# EAGLE design zok-atmega644-bob (EAGLE 6.5.0)
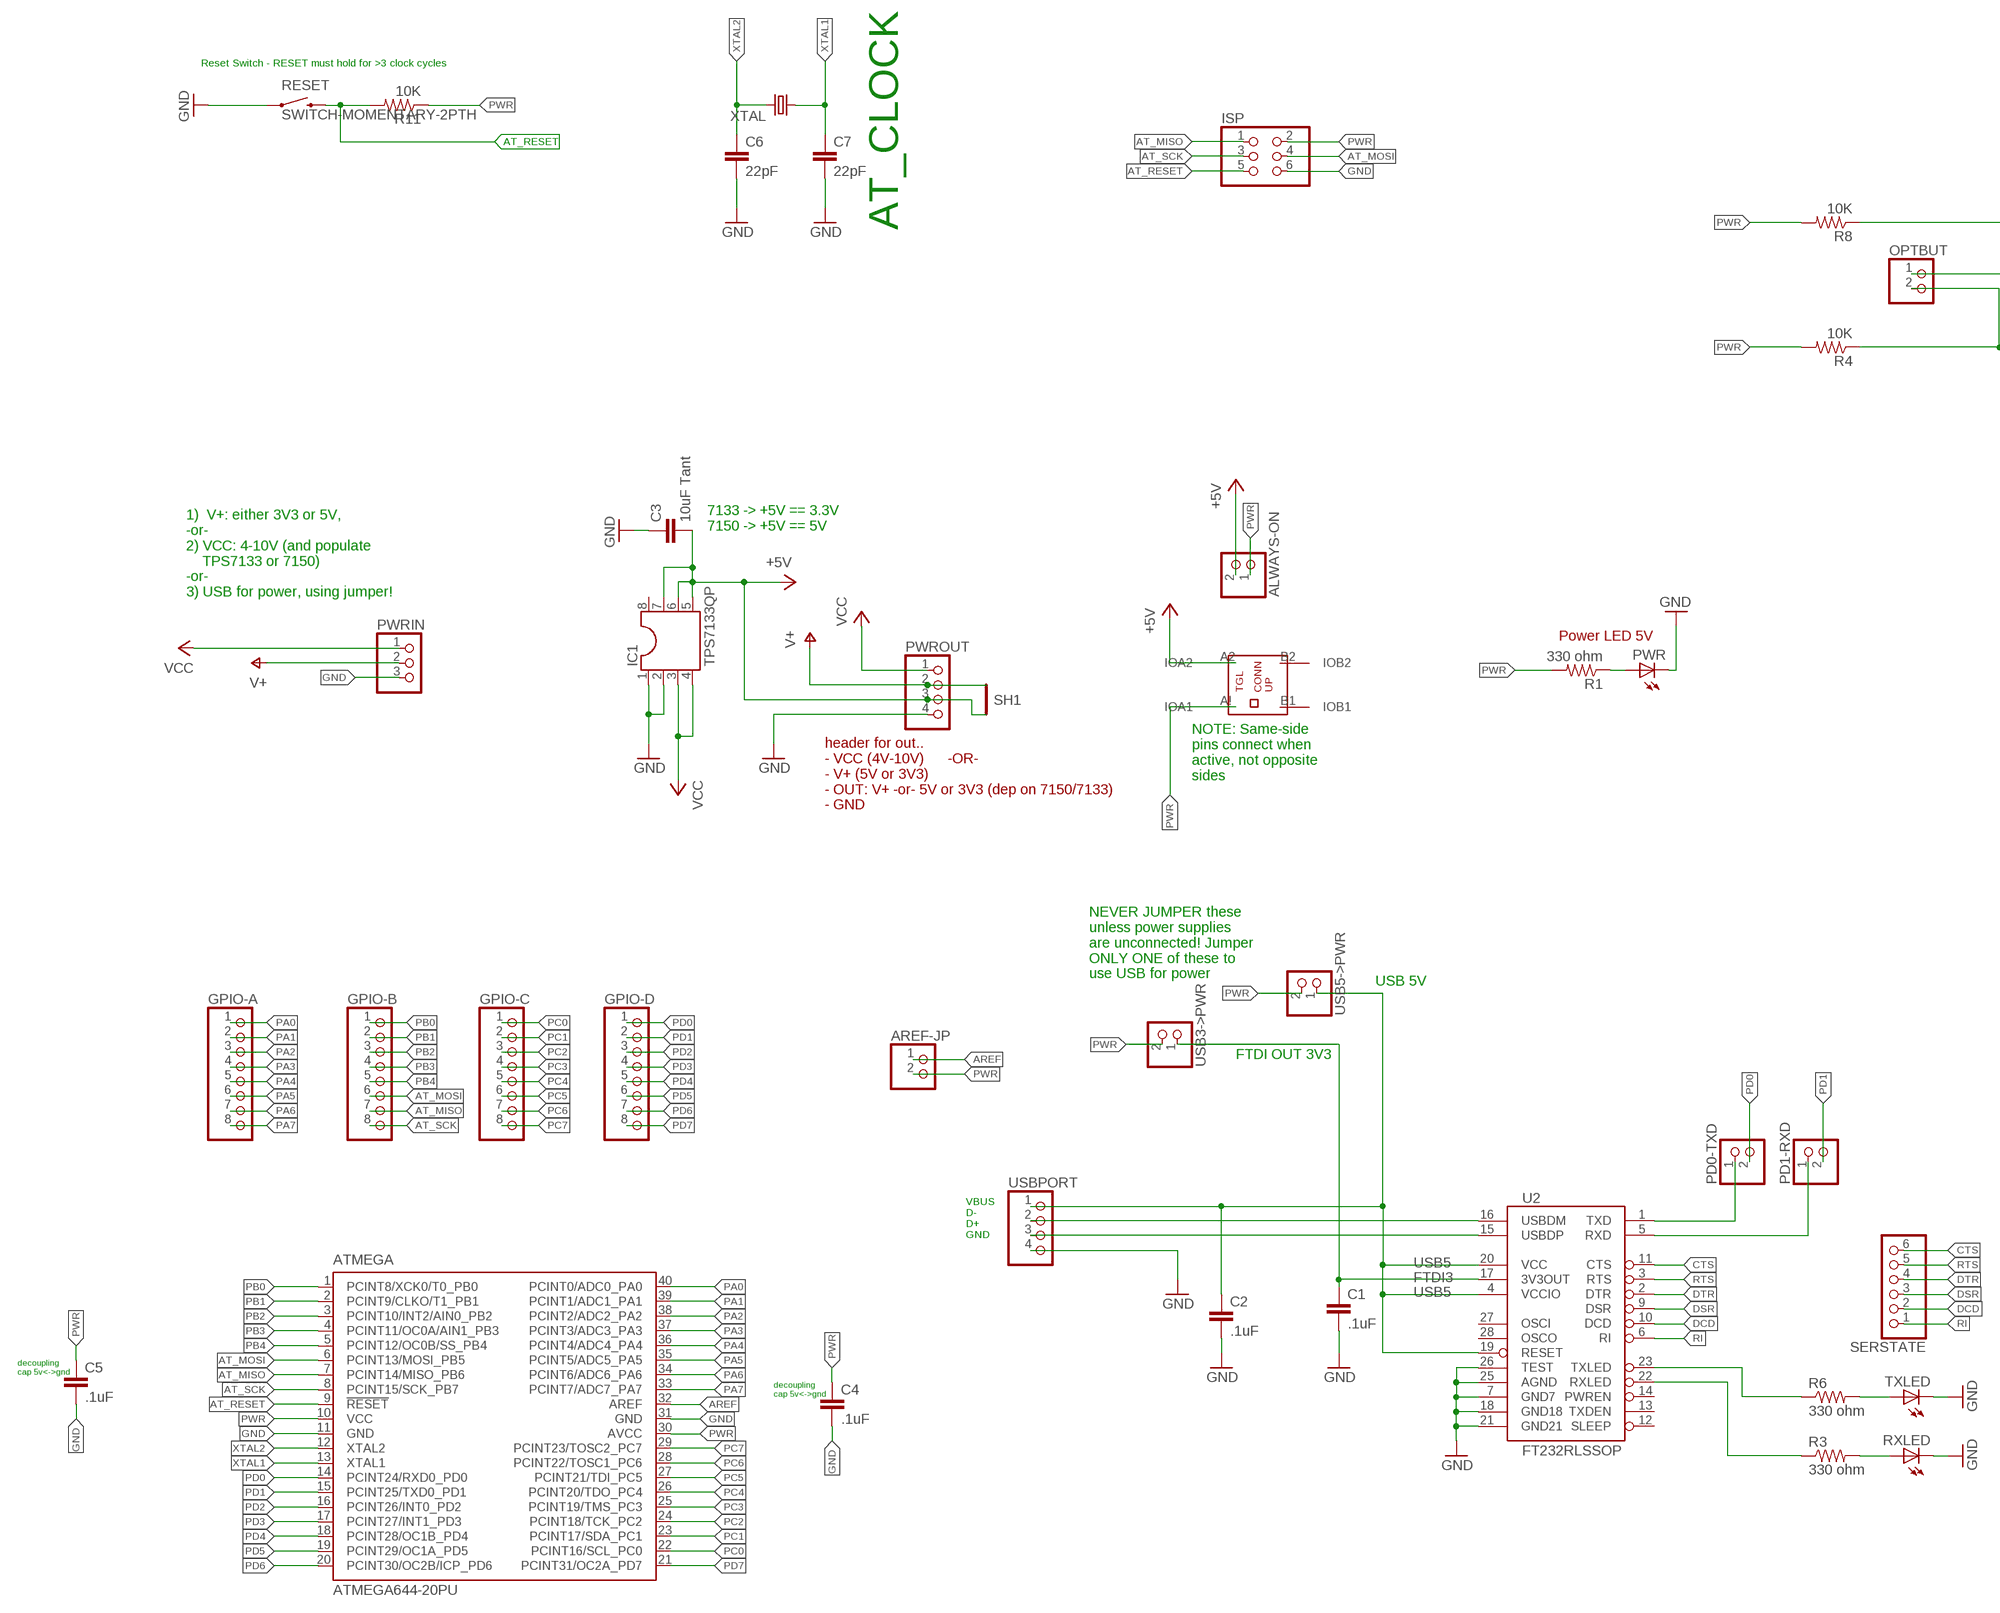
[diagram p0: schematic, sheet 1, part 1 of 2]
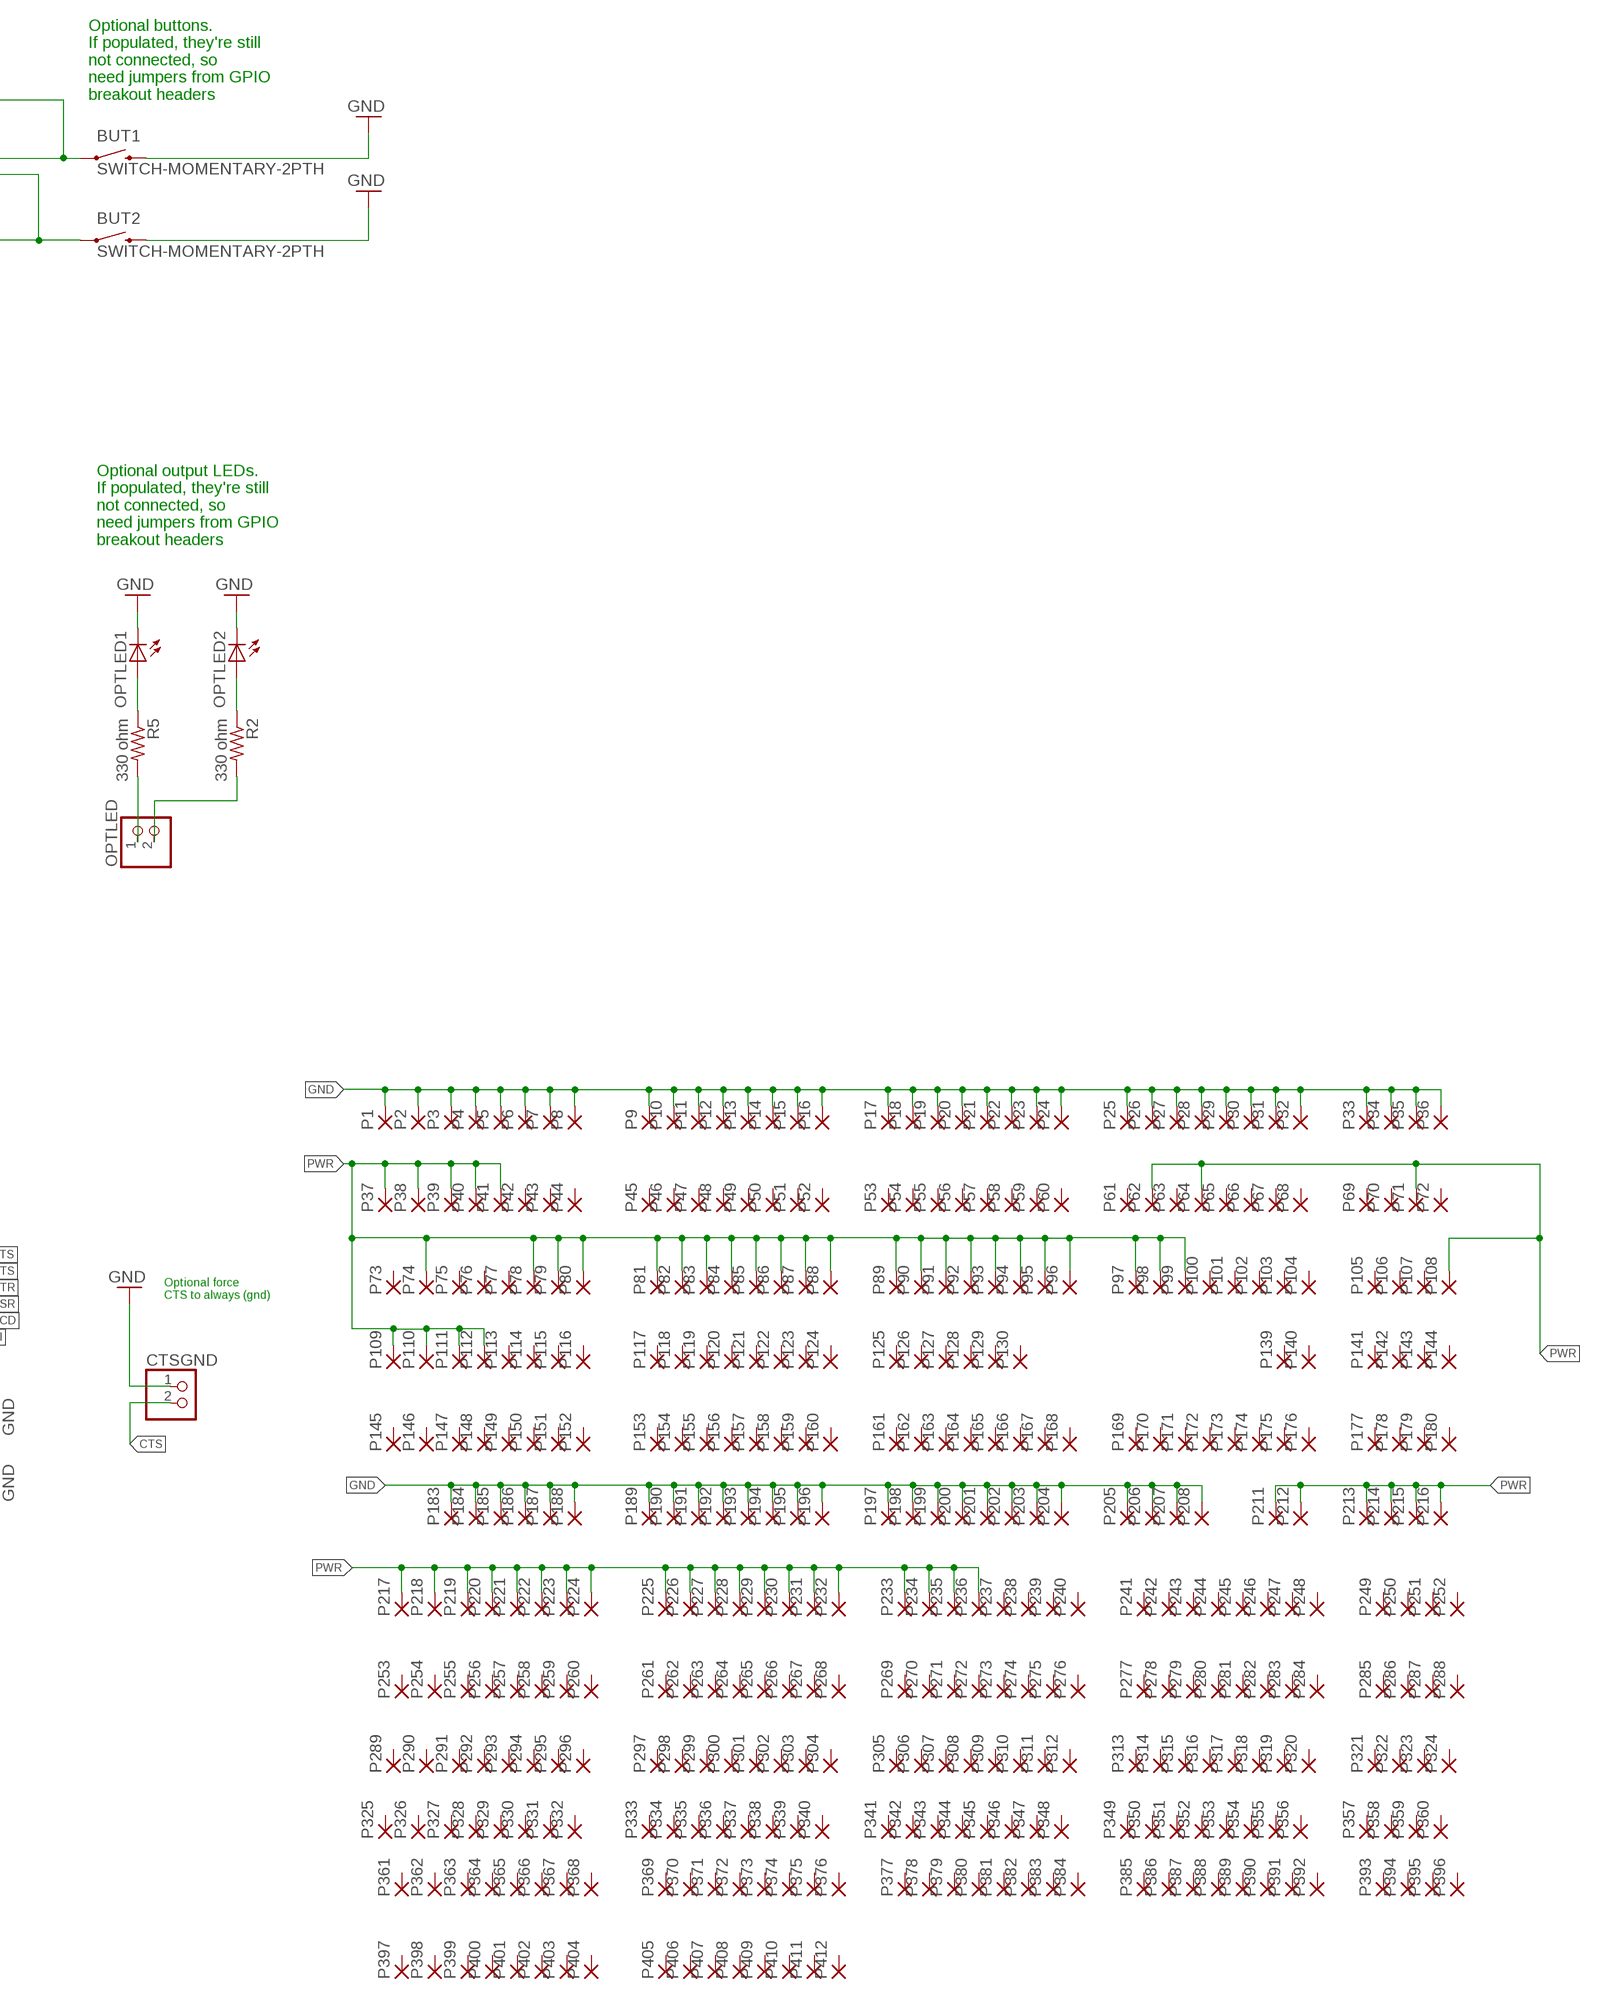
[diagram p1: schematic, sheet 1, part 2 of 2]

## Parts
ALWAYS-ON  PINHD-1X2  [1X02]
AREF-JP  PINHD-1X2  [1X02]
ATMEGA  ATMEGA644-20PU  [DIL40]
BUT1  SWITCH-MOMENTARY-2PTH  [TACTILE-PTH]
BUT2  SWITCH-MOMENTARY-2PTH  [TACTILE-PTH]
C1  .1uF  C-EU025-025X050  [C025-025X050]
C2  .1uF  C-EU025-025X050  [C025-025X050]
C3  10uF Tant  C-EU025-025X050  [C025-025X050]
C4  .1uF  C-EU025-025X050  [C025-025X050]
C5  .1uF  C-EU025-025X050  [C025-025X050]
C6  22pF  C-EU025-025X050  [C025-025X050]
C7  22pF  C-EU025-025X050  [C025-025X050]
CTSGND  PINHD-1X2  [1X02]
GPIO-A  PINHD-1X8  [1X08]
GPIO-B  PINHD-1X8  [1X08]
GPIO-C  PINHD-1X8  [1X08]
GPIO-D  PINHD-1X8  [1X08]
IC1  TPS7133QP  DIL8  [DIL08]
ISP  PINHD-2X3  [2X03]
OPTBUT  PINHD-1X2  [1X02]
OPTLED  PINHD-1X2  [1X02]
OPTLED1  LED5MM  [LED5MM]
OPTLED2  LED5MM  [LED5MM]
P1  1,6/0,9  [1,6/0,9]
P2  1,6/0,9  [1,6/0,9]
P3  1,6/0,9  [1,6/0,9]
P4  1,6/0,9  [1,6/0,9]
P5  1,6/0,9  [1,6/0,9]
P6  1,6/0,9  [1,6/0,9]
P7  1,6/0,9  [1,6/0,9]
P8  1,6/0,9  [1,6/0,9]
P9  1,6/0,9  [1,6/0,9]
P10  1,6/0,9  [1,6/0,9]
P11  1,6/0,9  [1,6/0,9]
P12  1,6/0,9  [1,6/0,9]
P13  1,6/0,9  [1,6/0,9]
P14  1,6/0,9  [1,6/0,9]
P15  1,6/0,9  [1,6/0,9]
P16  1,6/0,9  [1,6/0,9]
P17  1,6/0,9  [1,6/0,9]
P18  1,6/0,9  [1,6/0,9]
P19  1,6/0,9  [1,6/0,9]
P20  1,6/0,9  [1,6/0,9]
P21  1,6/0,9  [1,6/0,9]
P22  1,6/0,9  [1,6/0,9]
P23  1,6/0,9  [1,6/0,9]
P24  1,6/0,9  [1,6/0,9]
P25  1,6/0,9  [1,6/0,9]
P26  1,6/0,9  [1,6/0,9]
P27  1,6/0,9  [1,6/0,9]
P28  1,6/0,9  [1,6/0,9]
P29  1,6/0,9  [1,6/0,9]
P30  1,6/0,9  [1,6/0,9]
P31  1,6/0,9  [1,6/0,9]
P32  1,6/0,9  [1,6/0,9]
P33  1,6/0,9  [1,6/0,9]
P34  1,6/0,9  [1,6/0,9]
P35  1,6/0,9  [1,6/0,9]
P36  1,6/0,9  [1,6/0,9]
P37  1,6/0,9  [1,6/0,9]
P38  1,6/0,9  [1,6/0,9]
P39  1,6/0,9  [1,6/0,9]
P40  1,6/0,9  [1,6/0,9]
P41  1,6/0,9  [1,6/0,9]
P42  1,6/0,9  [1,6/0,9]
P43  1,6/0,9  [1,6/0,9]
P44  1,6/0,9  [1,6/0,9]
P45  1,6/0,9  [1,6/0,9]
P46  1,6/0,9  [1,6/0,9]
P47  1,6/0,9  [1,6/0,9]
P48  1,6/0,9  [1,6/0,9]
P49  1,6/0,9  [1,6/0,9]
P50  1,6/0,9  [1,6/0,9]
P51  1,6/0,9  [1,6/0,9]
P52  1,6/0,9  [1,6/0,9]
P53  1,6/0,9  [1,6/0,9]
P54  1,6/0,9  [1,6/0,9]
P55  1,6/0,9  [1,6/0,9]
P56  1,6/0,9  [1,6/0,9]
P57  1,6/0,9  [1,6/0,9]
P58  1,6/0,9  [1,6/0,9]
P59  1,6/0,9  [1,6/0,9]
P60  1,6/0,9  [1,6/0,9]
P61  1,6/0,9  [1,6/0,9]
P62  1,6/0,9  [1,6/0,9]
P63  1,6/0,9  [1,6/0,9]
P64  1,6/0,9  [1,6/0,9]
P65  1,6/0,9  [1,6/0,9]
P66  1,6/0,9  [1,6/0,9]
P67  1,6/0,9  [1,6/0,9]
P68  1,6/0,9  [1,6/0,9]
P69  1,6/0,9  [1,6/0,9]
P70  1,6/0,9  [1,6/0,9]
P71  1,6/0,9  [1,6/0,9]
P72  1,6/0,9  [1,6/0,9]
P73  1,6/0,9  [1,6/0,9]
P74  1,6/0,9  [1,6/0,9]
P75  1,6/0,9  [1,6/0,9]
P76  1,6/0,9  [1,6/0,9]
P77  1,6/0,9  [1,6/0,9]
P78  1,6/0,9  [1,6/0,9]
P79  1,6/0,9  [1,6/0,9]
P80  1,6/0,9  [1,6/0,9]
P81  1,6/0,9  [1,6/0,9]
P82  1,6/0,9  [1,6/0,9]
P83  1,6/0,9  [1,6/0,9]
P84  1,6/0,9  [1,6/0,9]
P85  1,6/0,9  [1,6/0,9]
P86  1,6/0,9  [1,6/0,9]
P87  1,6/0,9  [1,6/0,9]
P88  1,6/0,9  [1,6/0,9]
P89  1,6/0,9  [1,6/0,9]
P90  1,6/0,9  [1,6/0,9]
P91  1,6/0,9  [1,6/0,9]
P92  1,6/0,9  [1,6/0,9]
P93  1,6/0,9  [1,6/0,9]
P94  1,6/0,9  [1,6/0,9]
P95  1,6/0,9  [1,6/0,9]
P96  1,6/0,9  [1,6/0,9]
P97  1,6/0,9  [1,6/0,9]
P98  1,6/0,9  [1,6/0,9]
P99  1,6/0,9  [1,6/0,9]
P100  1,6/0,9  [1,6/0,9]
P101  1,6/0,9  [1,6/0,9]
P102  1,6/0,9  [1,6/0,9]
P103  1,6/0,9  [1,6/0,9]
P104  1,6/0,9  [1,6/0,9]
P105  1,6/0,9  [1,6/0,9]
P106  1,6/0,9  [1,6/0,9]
P107  1,6/0,9  [1,6/0,9]
P108  1,6/0,9  [1,6/0,9]
P109  1,6/0,9  [1,6/0,9]
P110  1,6/0,9  [1,6/0,9]
P111  1,6/0,9  [1,6/0,9]
P112  1,6/0,9  [1,6/0,9]
P113  1,6/0,9  [1,6/0,9]
P114  1,6/0,9  [1,6/0,9]
P115  1,6/0,9  [1,6/0,9]
P116  1,6/0,9  [1,6/0,9]
P117  1,6/0,9  [1,6/0,9]
P118  1,6/0,9  [1,6/0,9]
P119  1,6/0,9  [1,6/0,9]
P120  1,6/0,9  [1,6/0,9]
P121  1,6/0,9  [1,6/0,9]
P122  1,6/0,9  [1,6/0,9]
P123  1,6/0,9  [1,6/0,9]
P124  1,6/0,9  [1,6/0,9]
P125  1,6/0,9  [1,6/0,9]
P126  1,6/0,9  [1,6/0,9]
P127  1,6/0,9  [1,6/0,9]
P128  1,6/0,9  [1,6/0,9]
P129  1,6/0,9  [1,6/0,9]
P130  1,6/0,9  [1,6/0,9]
P139  1,6/0,9  [1,6/0,9]
P140  1,6/0,9  [1,6/0,9]
P141  1,6/0,9  [1,6/0,9]
P142  1,6/0,9  [1,6/0,9]
P143  1,6/0,9  [1,6/0,9]
P144  1,6/0,9  [1,6/0,9]
P145  1,6/0,9  [1,6/0,9]
P146  1,6/0,9  [1,6/0,9]
P147  1,6/0,9  [1,6/0,9]
P148  1,6/0,9  [1,6/0,9]
P149  1,6/0,9  [1,6/0,9]
P150  1,6/0,9  [1,6/0,9]
P151  1,6/0,9  [1,6/0,9]
P152  1,6/0,9  [1,6/0,9]
P153  1,6/0,9  [1,6/0,9]
P154  1,6/0,9  [1,6/0,9]
P155  1,6/0,9  [1,6/0,9]
P156  1,6/0,9  [1,6/0,9]
P157  1,6/0,9  [1,6/0,9]
P158  1,6/0,9  [1,6/0,9]
P159  1,6/0,9  [1,6/0,9]
P160  1,6/0,9  [1,6/0,9]
P161  1,6/0,9  [1,6/0,9]
P162  1,6/0,9  [1,6/0,9]
P163  1,6/0,9  [1,6/0,9]
P164  1,6/0,9  [1,6/0,9]
P165  1,6/0,9  [1,6/0,9]
P166  1,6/0,9  [1,6/0,9]
P167  1,6/0,9  [1,6/0,9]
P168  1,6/0,9  [1,6/0,9]
P169  1,6/0,9  [1,6/0,9]
P170  1,6/0,9  [1,6/0,9]
P171  1,6/0,9  [1,6/0,9]
P172  1,6/0,9  [1,6/0,9]
P173  1,6/0,9  [1,6/0,9]
P174  1,6/0,9  [1,6/0,9]
P175  1,6/0,9  [1,6/0,9]
P176  1,6/0,9  [1,6/0,9]
P177  1,6/0,9  [1,6/0,9]
P178  1,6/0,9  [1,6/0,9]
P179  1,6/0,9  [1,6/0,9]
P180  1,6/0,9  [1,6/0,9]
P183  1,6/0,9  [1,6/0,9]
P184  1,6/0,9  [1,6/0,9]
P185  1,6/0,9  [1,6/0,9]
P186  1,6/0,9  [1,6/0,9]
P187  1,6/0,9  [1,6/0,9]
P188  1,6/0,9  [1,6/0,9]
P189  1,6/0,9  [1,6/0,9]
P190  1,6/0,9  [1,6/0,9]
P191  1,6/0,9  [1,6/0,9]
P192  1,6/0,9  [1,6/0,9]
P193  1,6/0,9  [1,6/0,9]
P194  1,6/0,9  [1,6/0,9]
P195  1,6/0,9  [1,6/0,9]
P196  1,6/0,9  [1,6/0,9]
P197  1,6/0,9  [1,6/0,9]
P198  1,6/0,9  [1,6/0,9]
P199  1,6/0,9  [1,6/0,9]
P200  1,6/0,9  [1,6/0,9]
P201  1,6/0,9  [1,6/0,9]
P202  1,6/0,9  [1,6/0,9]
P203  1,6/0,9  [1,6/0,9]
P204  1,6/0,9  [1,6/0,9]
P205  1,6/0,9  [1,6/0,9]
P206  1,6/0,9  [1,6/0,9]
P207  1,6/0,9  [1,6/0,9]
P208  1,6/0,9  [1,6/0,9]
P211  1,6/0,9  [1,6/0,9]
P212  1,6/0,9  [1,6/0,9]
P213  1,6/0,9  [1,6/0,9]
P214  1,6/0,9  [1,6/0,9]
P215  1,6/0,9  [1,6/0,9]
P216  1,6/0,9  [1,6/0,9]
P217  1,6/0,9  [1,6/0,9]
P218  1,6/0,9  [1,6/0,9]
P219  1,6/0,9  [1,6/0,9]
P220  1,6/0,9  [1,6/0,9]
P221  1,6/0,9  [1,6/0,9]
P222  1,6/0,9  [1,6/0,9]
P223  1,6/0,9  [1,6/0,9]
P224  1,6/0,9  [1,6/0,9]
P225  1,6/0,9  [1,6/0,9]
P226  1,6/0,9  [1,6/0,9]
P227  1,6/0,9  [1,6/0,9]
P228  1,6/0,9  [1,6/0,9]
P229  1,6/0,9  [1,6/0,9]
P230  1,6/0,9  [1,6/0,9]
P231  1,6/0,9  [1,6/0,9]
P232  1,6/0,9  [1,6/0,9]
P233  1,6/0,9  [1,6/0,9]
P234  1,6/0,9  [1,6/0,9]
P235  1,6/0,9  [1,6/0,9]
P236  1,6/0,9  [1,6/0,9]
P237  1,6/0,9  [1,6/0,9]
P238  1,6/0,9  [1,6/0,9]
P239  1,6/0,9  [1,6/0,9]
P240  1,6/0,9  [1,6/0,9]
P241  1,6/0,9  [1,6/0,9]
P242  1,6/0,9  [1,6/0,9]
P243  1,6/0,9  [1,6/0,9]
P244  1,6/0,9  [1,6/0,9]
P245  1,6/0,9  [1,6/0,9]
P246  1,6/0,9  [1,6/0,9]
P247  1,6/0,9  [1,6/0,9]
P248  1,6/0,9  [1,6/0,9]
P249  1,6/0,9  [1,6/0,9]
P250  1,6/0,9  [1,6/0,9]
P251  1,6/0,9  [1,6/0,9]
P252  1,6/0,9  [1,6/0,9]
P253  1,6/0,9  [1,6/0,9]
P254  1,6/0,9  [1,6/0,9]
P255  1,6/0,9  [1,6/0,9]
P256  1,6/0,9  [1,6/0,9]
P257  1,6/0,9  [1,6/0,9]
P258  1,6/0,9  [1,6/0,9]
P259  1,6/0,9  [1,6/0,9]
P260  1,6/0,9  [1,6/0,9]
P261  1,6/0,9  [1,6/0,9]
P262  1,6/0,9  [1,6/0,9]
P263  1,6/0,9  [1,6/0,9]
P264  1,6/0,9  [1,6/0,9]
P265  1,6/0,9  [1,6/0,9]
P266  1,6/0,9  [1,6/0,9]
P267  1,6/0,9  [1,6/0,9]
P268  1,6/0,9  [1,6/0,9]
P269  1,6/0,9  [1,6/0,9]
P270  1,6/0,9  [1,6/0,9]
P271  1,6/0,9  [1,6/0,9]
P272  1,6/0,9  [1,6/0,9]
P273  1,6/0,9  [1,6/0,9]
P274  1,6/0,9  [1,6/0,9]
P275  1,6/0,9  [1,6/0,9]
P276  1,6/0,9  [1,6/0,9]
P277  1,6/0,9  [1,6/0,9]
P278  1,6/0,9  [1,6/0,9]
P279  1,6/0,9  [1,6/0,9]
P280  1,6/0,9  [1,6/0,9]
P281  1,6/0,9  [1,6/0,9]
P282  1,6/0,9  [1,6/0,9]
P283  1,6/0,9  [1,6/0,9]
P284  1,6/0,9  [1,6/0,9]
P285  1,6/0,9  [1,6/0,9]
P286  1,6/0,9  [1,6/0,9]
P287  1,6/0,9  [1,6/0,9]
P288  1,6/0,9  [1,6/0,9]
P289  1,6/0,9  [1,6/0,9]
P290  1,6/0,9  [1,6/0,9]
P291  1,6/0,9  [1,6/0,9]
P292  1,6/0,9  [1,6/0,9]
P293  1,6/0,9  [1,6/0,9]
P294  1,6/0,9  [1,6/0,9]
P295  1,6/0,9  [1,6/0,9]
P296  1,6/0,9  [1,6/0,9]
P297  1,6/0,9  [1,6/0,9]
P298  1,6/0,9  [1,6/0,9]
P299  1,6/0,9  [1,6/0,9]
P300  1,6/0,9  [1,6/0,9]
P301  1,6/0,9  [1,6/0,9]
P302  1,6/0,9  [1,6/0,9]
P303  1,6/0,9  [1,6/0,9]
P304  1,6/0,9  [1,6/0,9]
P305  1,6/0,9  [1,6/0,9]
P306  1,6/0,9  [1,6/0,9]
P307  1,6/0,9  [1,6/0,9]
P308  1,6/0,9  [1,6/0,9]
P309  1,6/0,9  [1,6/0,9]
P310  1,6/0,9  [1,6/0,9]
P311  1,6/0,9  [1,6/0,9]
P312  1,6/0,9  [1,6/0,9]
P313  1,6/0,9  [1,6/0,9]
P314  1,6/0,9  [1,6/0,9]
P315  1,6/0,9  [1,6/0,9]
P316  1,6/0,9  [1,6/0,9]
P317  1,6/0,9  [1,6/0,9]
P318  1,6/0,9  [1,6/0,9]
P319  1,6/0,9  [1,6/0,9]
P320  1,6/0,9  [1,6/0,9]
P321  1,6/0,9  [1,6/0,9]
P322  1,6/0,9  [1,6/0,9]
P323  1,6/0,9  [1,6/0,9]
P324  1,6/0,9  [1,6/0,9]
P325  1,6/0,9  [1,6/0,9]
P326  1,6/0,9  [1,6/0,9]
P327  1,6/0,9  [1,6/0,9]
P328  1,6/0,9  [1,6/0,9]
P329  1,6/0,9  [1,6/0,9]
P330  1,6/0,9  [1,6/0,9]
P331  1,6/0,9  [1,6/0,9]
P332  1,6/0,9  [1,6/0,9]
P333  1,6/0,9  [1,6/0,9]
P334  1,6/0,9  [1,6/0,9]
P335  1,6/0,9  [1,6/0,9]
P336  1,6/0,9  [1,6/0,9]
P337  1,6/0,9  [1,6/0,9]
P338  1,6/0,9  [1,6/0,9]
P339  1,6/0,9  [1,6/0,9]
P340  1,6/0,9  [1,6/0,9]
P341  1,6/0,9  [1,6/0,9]
P342  1,6/0,9  [1,6/0,9]
P343  1,6/0,9  [1,6/0,9]
P344  1,6/0,9  [1,6/0,9]
P345  1,6/0,9  [1,6/0,9]
P346  1,6/0,9  [1,6/0,9]
P347  1,6/0,9  [1,6/0,9]
P348  1,6/0,9  [1,6/0,9]
P349  1,6/0,9  [1,6/0,9]
P350  1,6/0,9  [1,6/0,9]
P351  1,6/0,9  [1,6/0,9]
P352  1,6/0,9  [1,6/0,9]
P353  1,6/0,9  [1,6/0,9]
P354  1,6/0,9  [1,6/0,9]
P355  1,6/0,9  [1,6/0,9]
P356  1,6/0,9  [1,6/0,9]
P357  1,6/0,9  [1,6/0,9]
P358  1,6/0,9  [1,6/0,9]
P359  1,6/0,9  [1,6/0,9]
P360  1,6/0,9  [1,6/0,9]
P361  1,6/0,9  [1,6/0,9]
P362  1,6/0,9  [1,6/0,9]
P363  1,6/0,9  [1,6/0,9]
P364  1,6/0,9  [1,6/0,9]
P365  1,6/0,9  [1,6/0,9]
P366  1,6/0,9  [1,6/0,9]
P367  1,6/0,9  [1,6/0,9]
P368  1,6/0,9  [1,6/0,9]
P369  1,6/0,9  [1,6/0,9]
P370  1,6/0,9  [1,6/0,9]
P371  1,6/0,9  [1,6/0,9]
P372  1,6/0,9  [1,6/0,9]
P373  1,6/0,9  [1,6/0,9]
P374  1,6/0,9  [1,6/0,9]
P375  1,6/0,9  [1,6/0,9]
P376  1,6/0,9  [1,6/0,9]
P377  1,6/0,9  [1,6/0,9]
P378  1,6/0,9  [1,6/0,9]
P379  1,6/0,9  [1,6/0,9]
P380  1,6/0,9  [1,6/0,9]
P381  1,6/0,9  [1,6/0,9]
P382  1,6/0,9  [1,6/0,9]
P383  1,6/0,9  [1,6/0,9]
P384  1,6/0,9  [1,6/0,9]
P385  1,6/0,9  [1,6/0,9]
P386  1,6/0,9  [1,6/0,9]
P387  1,6/0,9  [1,6/0,9]
P388  1,6/0,9  [1,6/0,9]
P389  1,6/0,9  [1,6/0,9]
P390  1,6/0,9  [1,6/0,9]
P391  1,6/0,9  [1,6/0,9]
P392  1,6/0,9  [1,6/0,9]
P393  1,6/0,9  [1,6/0,9]
P394  1,6/0,9  [1,6/0,9]
P395  1,6/0,9  [1,6/0,9]
P396  1,6/0,9  [1,6/0,9]
P397  1,6/0,9  [1,6/0,9]
P398  1,6/0,9  [1,6/0,9]
P399  1,6/0,9  [1,6/0,9]
P400  1,6/0,9  [1,6/0,9]
P401  1,6/0,9  [1,6/0,9]
P402  1,6/0,9  [1,6/0,9]
P403  1,6/0,9  [1,6/0,9]
P404  1,6/0,9  [1,6/0,9]
P405  1,6/0,9  [1,6/0,9]
P406  1,6/0,9  [1,6/0,9]
P407  1,6/0,9  [1,6/0,9]
P408  1,6/0,9  [1,6/0,9]
P409  1,6/0,9  [1,6/0,9]
P410  1,6/0,9  [1,6/0,9]
P411  1,6/0,9  [1,6/0,9]
P412  1,6/0,9  [1,6/0,9]
PD0-TXD  PINHD-1X2  [1X02]
PD1-RXD  PINHD-1X2  [1X02]
PWR  LED5MM  [LED5MM]
PWRIN  PINHD-1X3  [1X03]
PWROUT  PINHD-1X4  [1X04]
R1  330 ohm  R-US_0204/7  [0204/7]
R2  330 ohm  R-US_0204/7  [0204/7]
R3  330 ohm  R-US_0204/7  [0204/7]
R4  10K  R-US_0204/7  [0204/7]
R5  330 ohm  R-US_0204/7  [0204/7]
R6  330 ohm  R-US_0204/7  [0204/7]
R8  10K  R-US_0204/7  [0204/7]
R11  10K  R-US_0204/7  [0204/7]
RESET  SWITCH-MOMENTARY-2PTH  [TACTILE-PTH]
RXLED  LED5MM  [LED5MM]
SERSTATE  PINHD-1X6  [1X06]
SH1  SHORT-VT5  [SHORT_TOP-50]
TXLED  LED5MM  [LED5MM]
U2  FT232RLSSOP  [SSOP28DB]
U$4  TOGGLE-CYAN-L-ZIK  [TOGGLE-CYAN-LG-ZIK]
USB3->PWR  PINHD-1X2  [1X02]
USB5->PWR  PINHD-1X2  [1X02]
USBPORT  PINHD-1X4  [1X04]
XTAL  CRYSTALHC49S  [HC49/S]

## Nets
+5V: ALWAYS-ON.2 C3.2 IC1.5 IC1.6 IC1.7 PWROUT.3 SH1.1 U$4.A2(IOA2)
AREF: AREF-JP.1 ATMEGA.32(AREF)
AT_MISO: ATMEGA.7(PCINT14/MISO_PB6) GPIO-B.7 ISP.1
AT_MOSI: ATMEGA.6(PCINT13/MOSI_PB5) GPIO-B.6 ISP.4
AT_RESET: ATMEGA.9(!RESET) ISP.5 R11.2 RESET.3
AT_SCK: ATMEGA.8(PCINT15/SCK_PB7) GPIO-B.8 ISP.3
CTS: CTSGND.2 SERSTATE.6 U2.11(CTS)
DCD: SERSTATE.2 U2.10(DCD)
DSR: SERSTATE.3 U2.9(DSR)
DTR: SERSTATE.4 U2.2(DTR)
FTDI3 [power]: C1.1 U2.17(3V3OUT) USB3->PWR.1
GND [power]: ATMEGA.11(GND) ATMEGA.31(GND) BUT1.3 BUT2.3 C1.2 C2.2 C3.1 C4.2 C5.2 C6.2 C7.2 CTSGND.1 IC1.1 IC1.2 ISP.6 OPTLED1.K(C) OPTLED2.K(C) P1.1(P) P2.1(P) P3.1(P) P4.1(P) P5.1(P) P6.1(P) P7.1(P) P8.1(P) P9.1(P) P10.1(P) P11.1(P) P12.1(P) P13.1(P) P14.1(P) P15.1(P) P16.1(P) P17.1(P) P18.1(P) P19.1(P) P20.1(P) P21.1(P) P22.1(P) P23.1(P) P24.1(P) P25.1(P) P26.1(P) P27.1(P) P28.1(P) P29.1(P) P30.1(P) P31.1(P) P32.1(P) P33.1(P) P34.1(P) P35.1(P) P36.1(P) P183.1(P) P184.1(P) P185.1(P) P186.1(P) P187.1(P) P188.1(P) P189.1(P) P190.1(P) P191.1(P) P192.1(P) P193.1(P) P194.1(P) P195.1(P) P196.1(P) P197.1(P) P198.1(P) P199.1(P) P200.1(P) P201.1(P) P202.1(P) P203.1(P) P204.1(P) P205.1(P) P206.1(P) P207.1(P) P208.1(P) PWR.K(C) PWRIN.3 PWROUT.4 RESET.1 RXLED.K(C) TXLED.K(C) U2.7(GND7) U2.18(GND18) U2.21(GND21) U2.25(AGND) U2.26(TEST) USBPORT.4
N$1: BUT1.1 OPTBUT.1 R8.1
N$2: BUT2.1 OPTBUT.2 R4.1
N$3: PWR.A R1.1
N$4: R6.2 TXLED.A
N$5: OPTLED.1 R5.2
N$6: OPTLED2.A R2.1
N$7: OPTLED.2 R2.2
N$8: R6.1 U2.23(TXLED)
N$9: OPTLED1.A R5.1
N$10: R3.2 RXLED.A
N$11: R3.1 U2.22(RXLED)
N$12: PD0-TXD.1 U2.1(TXD)
N$13: PD1-RXD.1 U2.5(RXD)
PA0: ATMEGA.40(PCINT0/ADC0_PA0) GPIO-A.1
PA1: ATMEGA.39(PCINT1/ADC1_PA1) GPIO-A.2
PA2: ATMEGA.38(PCINT2/ADC2_PA2) GPIO-A.3
PA3: ATMEGA.37(PCINT3/ADC3_PA3) GPIO-A.4
PA4: ATMEGA.36(PCINT4/ADC4_PA4) GPIO-A.5
PA5: ATMEGA.35(PCINT5/ADC5_PA5) GPIO-A.6
PA6: ATMEGA.34(PCINT6/ADC6_PA6) GPIO-A.7
PA7: ATMEGA.33(PCINT7/ADC7_PA7) GPIO-A.8
PB0: ATMEGA.1(PCINT8/XCK0/T0_PB0) GPIO-B.1
PB1: ATMEGA.2(PCINT9/CLKO/T1_PB1) GPIO-B.2
PB2: ATMEGA.3(PCINT10/INT2/AIN0_PB2) GPIO-B.3
PB3: ATMEGA.4(PCINT11/OC0A/AIN1_PB3) GPIO-B.4
PB4: ATMEGA.5(PCINT12/OC0B/SS_PB4) GPIO-B.5
PC0: ATMEGA.22(PCINT16/SCL_PC0) GPIO-C.1
PC1: ATMEGA.23(PCINT17/SDA_PC1) GPIO-C.2
PC2: ATMEGA.24(PCINT18/TCK_PC2) GPIO-C.3
PC3: ATMEGA.25(PCINT19/TMS_PC3) GPIO-C.4
PC4: ATMEGA.26(PCINT20/TDO_PC4) GPIO-C.5
PC5: ATMEGA.27(PCINT21/TDI_PC5) GPIO-C.6
PC6: ATMEGA.28(PCINT22/TOSC1_PC6) GPIO-C.7
PC7: ATMEGA.29(PCINT23/TOSC2_PC7) GPIO-C.8
PD0: ATMEGA.14(PCINT24/RXD0_PD0) GPIO-D.1 PD0-TXD.2
PD1: ATMEGA.15(PCINT25/TXD0_PD1) GPIO-D.2 PD1-RXD.2
PD2: ATMEGA.16(PCINT26/INT0_PD2) GPIO-D.3
PD3: ATMEGA.17(PCINT27/INT1_PD3) GPIO-D.4
PD4: ATMEGA.18(PCINT28/OC1B_PD4) GPIO-D.5
PD5: ATMEGA.19(PCINT29/OC1A_PD5) GPIO-D.6
PD6: ATMEGA.20(PCINT30/OC2B/ICP_PD6) GPIO-D.7
PD7: ATMEGA.21(PCINT31/OC2A_PD7) GPIO-D.8
PWR: ALWAYS-ON.1 AREF-JP.2 ATMEGA.10(VCC) ATMEGA.30(AVCC) C4.1 C5.1 ISP.2 P37.1(P) P38.1(P) P39.1(P) P40.1(P) P41.1(P) P62.1(P) P64.1(P) P71.1(P) P74.1(P) P78.1(P) P79.1(P) P80.1(P) P81.1(P) P82.1(P) P83.1(P) P84.1(P) P85.1(P) P86.1(P) P87.1(P) P88.1(P) P89.1(P) P90.1(P) P91.1(P) P92.1(P) P93.1(P) P94.1(P) P95.1(P) P96.1(P) P97.1(P) P98.1(P) P99.1(P) P108.1(P) P109.1(P) P110.1(P) P111.1(P) P112.1(P) P211.1(P) P212.1(P) P213.1(P) P214.1(P) P215.1(P) P216.1(P) P217.1(P) P218.1(P) P219.1(P) P220.1(P) P221.1(P) P222.1(P) P223.1(P) P224.1(P) P225.1(P) P226.1(P) P227.1(P) P228.1(P) P229.1(P) P230.1(P) P231.1(P) P232.1(P) P233.1(P) P234.1(P) P235.1(P) P236.1(P) R1.2 R4.2 R8.2 R11.1 U$4.A!(IOA1) USB3->PWR.2 USB5->PWR.2
RI: SERSTATE.1 U2.6(RI)
RTS: SERSTATE.5 U2.3(RTS)
USB5: C2.1 U2.4(VCCIO) U2.19(RESET) U2.20(VCC) USB5->PWR.1 USBPORT.1
USB_D+: U2.15(USBDP) USBPORT.3
USB_D-: U2.16(USBDM) USBPORT.2
V+: PWRIN.2 PWROUT.2 SH1.2
VCC: IC1.3 IC1.4 PWRIN.1 PWROUT.1
XTAL1: ATMEGA.13(XTAL1) C7.1 XTAL.1
XTAL2: ATMEGA.12(XTAL2) C6.1 XTAL.2
Unconnected: IC1.8 P42.1(P) P43.1(P) P44.1(P) P45.1(P) P46.1(P) P47.1(P) P48.1(P) P49.1(P) P50.1(P) P51.1(P) P52.1(P) P53.1(P) P54.1(P) P55.1(P) P56.1(P) P57.1(P) P58.1(P) P59.1(P) P60.1(P) P61.1(P) P63.1(P) P65.1(P) P66.1(P) P67.1(P) P68.1(P) P69.1(P) P70.1(P) P72.1(P) P73.1(P) P75.1(P) P76.1(P) P77.1(P) P100.1(P) P101.1(P) P102.1(P) P103.1(P) P104.1(P) P105.1(P) P106.1(P) P107.1(P) P113.1(P) P114.1(P) P115.1(P) P116.1(P) P117.1(P) P118.1(P) P119.1(P) P120.1(P) P121.1(P) P122.1(P) P123.1(P) P124.1(P) P125.1(P) P126.1(P) P127.1(P) P128.1(P) P129.1(P) P130.1(P) P139.1(P) P140.1(P) P141.1(P) P142.1(P) P143.1(P) P144.1(P) P145.1(P) P146.1(P) P147.1(P) P148.1(P) P149.1(P) P150.1(P) P151.1(P) P152.1(P) P153.1(P) P154.1(P) P155.1(P) P156.1(P) P157.1(P) P158.1(P) P159.1(P) P160.1(P) P161.1(P) P162.1(P) P163.1(P) P164.1(P) P165.1(P) P166.1(P) P167.1(P) P168.1(P) P169.1(P) P170.1(P) P171.1(P) P172.1(P) P173.1(P) P174.1(P) P175.1(P) P176.1(P) P177.1(P) P178.1(P) P179.1(P) P180.1(P) P237.1(P) P238.1(P) P239.1(P) P240.1(P) P241.1(P) P242.1(P) P243.1(P) P244.1(P) P245.1(P) P246.1(P) P247.1(P) P248.1(P) P249.1(P) P250.1(P) P251.1(P) P252.1(P) P253.1(P) P254.1(P) P255.1(P) P256.1(P) P257.1(P) P258.1(P) P259.1(P) P260.1(P) P261.1(P) P262.1(P) P263.1(P) P264.1(P) P265.1(P) P266.1(P) P267.1(P) P268.1(P) P269.1(P) P270.1(P) P271.1(P) P272.1(P) P273.1(P) P274.1(P) P275.1(P) P276.1(P) P277.1(P) P278.1(P) P279.1(P) P280.1(P) P281.1(P) P282.1(P) P283.1(P) P284.1(P) P285.1(P) P286.1(P) P287.1(P) P288.1(P) P289.1(P) P290.1(P) P291.1(P) P292.1(P) P293.1(P) P294.1(P) P295.1(P) P296.1(P) P297.1(P) P298.1(P) P299.1(P) P300.1(P) P301.1(P) P302.1(P) P303.1(P) P304.1(P) P305.1(P) P306.1(P) P307.1(P) P308.1(P) P309.1(P) P310.1(P) P311.1(P) P312.1(P) P313.1(P) P314.1(P) P315.1(P) P316.1(P) P317.1(P) P318.1(P) P319.1(P) P320.1(P) P321.1(P) P322.1(P) P323.1(P) P324.1(P) P325.1(P) P326.1(P) P327.1(P) P328.1(P) P329.1(P) P330.1(P) P331.1(P) P332.1(P) P333.1(P) P334.1(P) P335.1(P) P336.1(P) P337.1(P) P338.1(P) P339.1(P) P340.1(P) P341.1(P) P342.1(P) P343.1(P) P344.1(P) P345.1(P) P346.1(P) P347.1(P) P348.1(P) P349.1(P) P350.1(P) P351.1(P) P352.1(P) P353.1(P) P354.1(P) P355.1(P) P356.1(P) P357.1(P) P358.1(P) P359.1(P) P360.1(P) P361.1(P) P362.1(P) P363.1(P) P364.1(P) P365.1(P) P366.1(P) P367.1(P) P368.1(P) P369.1(P) P370.1(P) P371.1(P) P372.1(P) P373.1(P) P374.1(P) P375.1(P) P376.1(P) P377.1(P) P378.1(P) P379.1(P) P380.1(P) P381.1(P) P382.1(P) P383.1(P) P384.1(P) P385.1(P) P386.1(P) P387.1(P) P388.1(P) P389.1(P) P390.1(P) P391.1(P) P392.1(P) P393.1(P) P394.1(P) P395.1(P) P396.1(P) P397.1(P) P398.1(P) P399.1(P) P400.1(P) P401.1(P) P402.1(P) P403.1(P) P404.1(P) P405.1(P) P406.1(P) P407.1(P) P408.1(P) P409.1(P) P410.1(P) P411.1(P) P412.1(P) U2.12(SLEEP) U2.13(TXDEN) U2.14(PWREN) U2.27(OSCI) U2.28(OSCO) U$4.B1(IOB1) U$4.B2(IOB2)

## Notes on the sheet
- Reset Switch - RESET must hold for >3 clock cycles
- Optional buttons.
  If populated, they're still
  not connected, so
  need jumpers from GPIO
  breakout headers
- AT_CLOCK
- 7133 -> +5V == 3.3V
  7150 -> +5V == 5V
- 1)  V+: either 3V3 or 5V,
  -or-
  2) VCC: 4-10V (and populate
      TPS7133 or 7150)
  -or-
  3) USB for power, using jumper!
- Optional output LEDs.
  If populated, they're still
  not connected, so
  need jumpers from GPIO
  breakout headers
- Power LED 5V
- NOTE: Same-side
  pins connect when
  active, not opposite
  sides
- header for out..
  - VCC (4V-10V)      -OR-
  - V+ (5V or 3V3)
  - OUT: V+ -or- 5V or 3V3 (dep on 7150/7133)
  - GND
- NEVER JUMPER these
  unless power supplies
  are unconnected! Jumper
  ONLY ONE of these to
  use USB for power
- USB 5V
- FTDI OUT 3V3
- VBUS
  D-
  D+
  GND
- Optional force
  CTS to always (gnd)
- decoupling
  cap 5v<->gnd
- decoupling
  cap 5v<->gnd

## Library data of the parts
ALWAYS-ON AREF-JP CTSGND OPTBUT OPTLED PD0-TXD PD1-RXD USB3->PWR USB5->PWR = pinhead:PINHD-1X2: PIN HEADER
ATMEGA = atmel:ATMEGA644-*PU: 8-bit Microcontroller with 64K Bytes In-System Programmable Flash Auto generated by make-symbol-device-package-bsdl.ulp Rev. 34 Source: http://www.atmel.com/dyn/resources/prod_documents/doc2593.pdf; MPN: ATMEGA644-20PU; OC_FARNELL: 1288340; OC_NEWARK: 23M5060
BUT1 BUT2 RESET = SparkFun-Electromechanical:SWITCH-MOMENTARY-2: Various NO switches- pushbuttons, reed, etc
C1-C7 = rcl:C-EU: CAPACITOR, European symbol
GPIO-A GPIO-B GPIO-C GPIO-D = pinhead:PINHD-1X8: PIN HEADER
IC1 = ic-package:DIL8: Dual In Line / Socket
ISP = pinhead:PINHD-2X3: PIN HEADER
OPTLED1 OPTLED2 PWR RXLED TXLED = SparkFun-LED:LED: LEDs Standard schematic elements and footprints for 5mm, 3mm, 1206, and 0603 sized LEDs. 5mm - Spark Fun Electronics SKU : COM-00529 (and others)
P1-P130 P139-P180 P183-P208 P211-P412 = wirepad:1,6/0,9: THROUGH-HOLE PAD
PWRIN = pinhead:PINHD-1X3: PIN HEADER
PWROUT USBPORT = pinhead:PINHD-1X4: PIN HEADER
R1-R6 R8 R11 = rcl:R-US_: RESISTOR, American symbol
SERSTATE = pinhead:PINHD-1X6: PIN HEADER
SH1 = wire-shorts:SHORT-V: Short between two nets; BOM: no
U2 = SparkFun:FT232RL: USB UART FT232RL 4th Generation USB UART (USB <-> Serial) Controller. Spark Fun Electronics SKU : COM-00650
U$4 = skeezix:TOGGLE-CYAN-L-ZIK
XTAL = adafruit:CRYSTAL: CRYSTAL; OC_FARNELL: 1667008; OC_NEWARK: unknown

## Net classes
1 power: width 0.254 mm

## Board
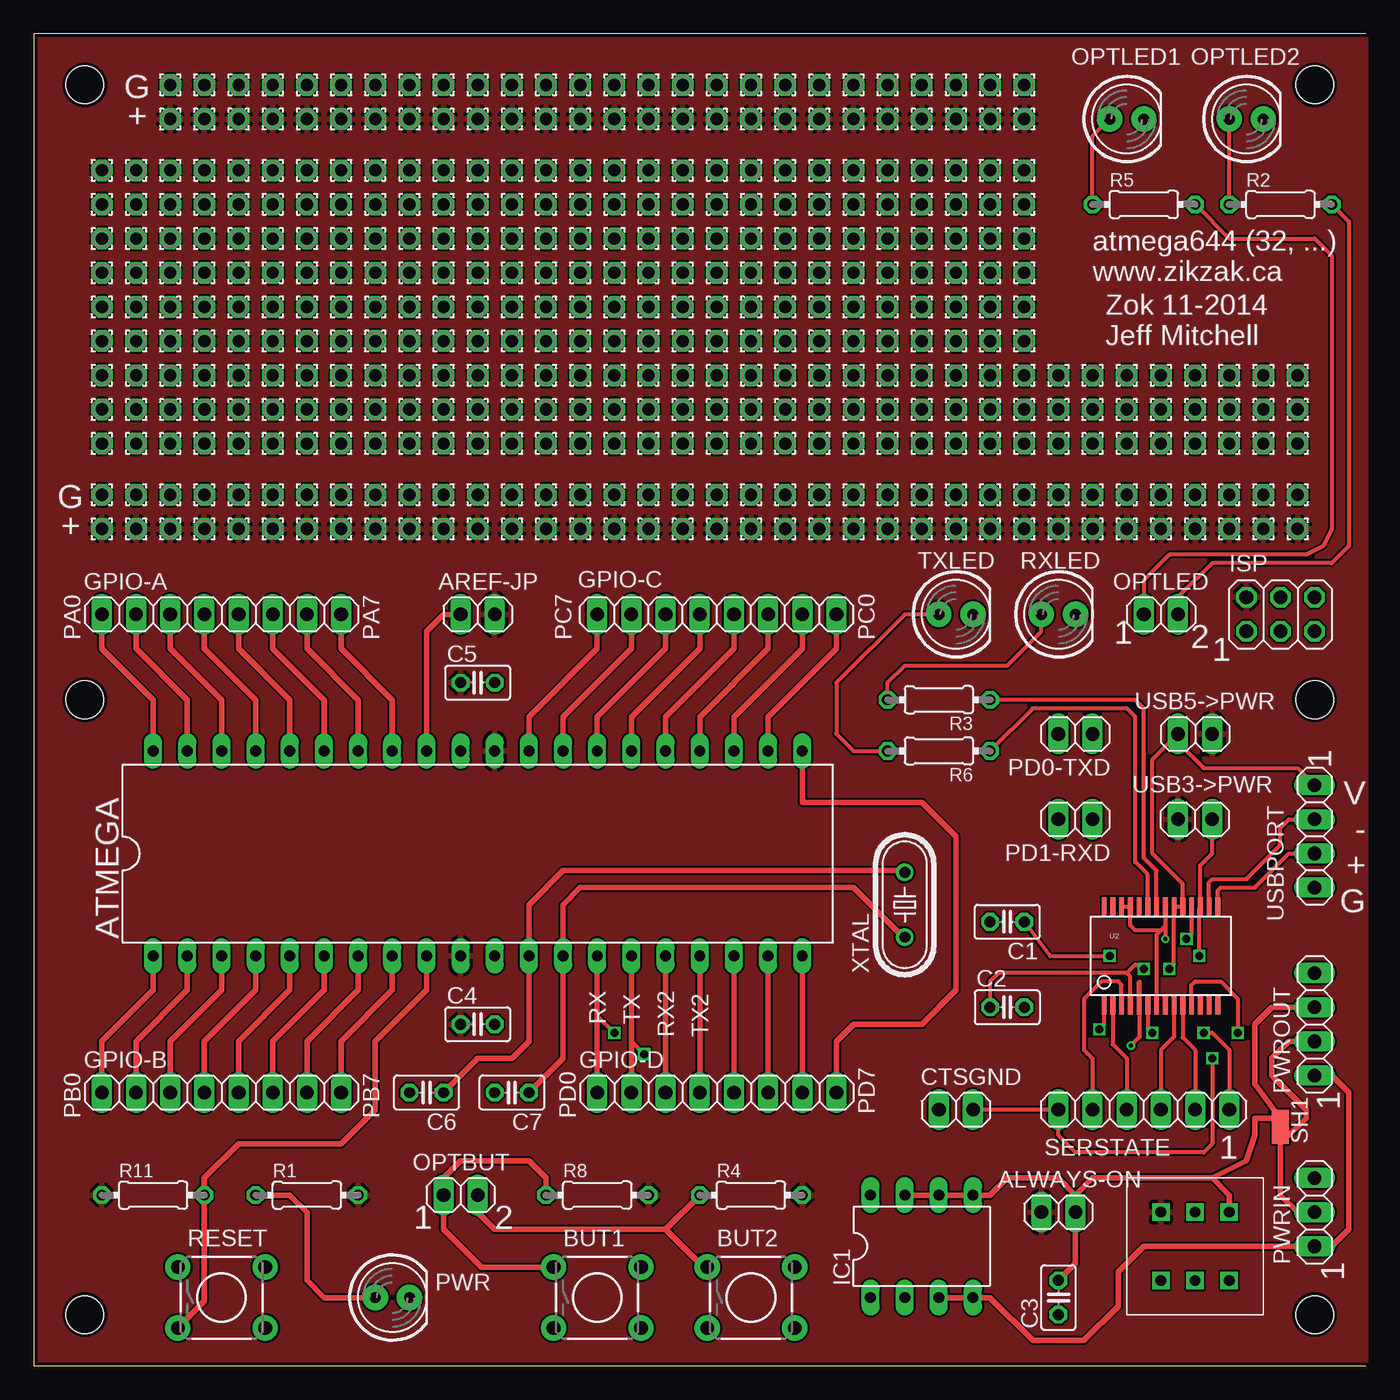
[diagram p2: board, top side]
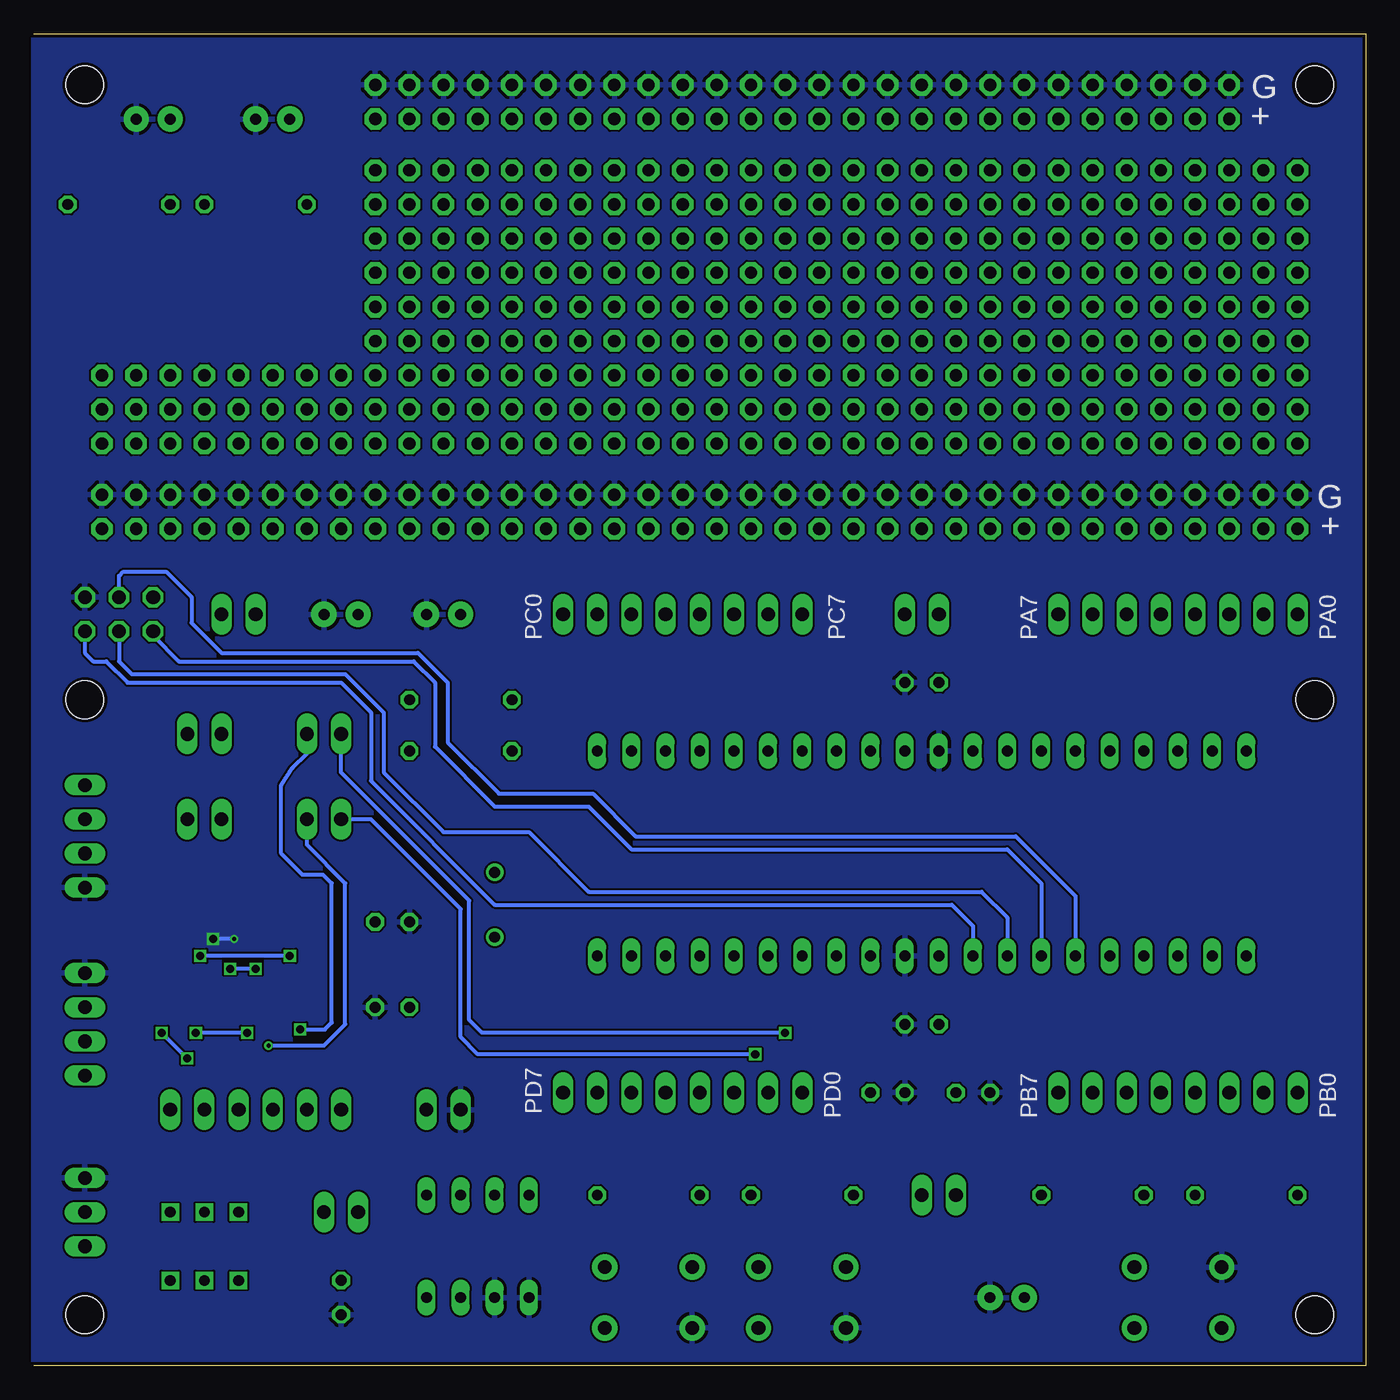
[diagram p3: board, bottom side, seen from below]

Size 99.06 x 99.06 mm. Coordinates in mm from the lower left corner, seen from the top.
Outline: 99.06,0 0,0 0,99.06 99.06,99.06
Copper layers (1*16): Top 0.035mm / dielectric 1.5mm / Bottom 0.035mm
Design rules "Elecrow_2-layer_eagle_rule": minimum track width 6mil, minimum drill 12mil, track to track 6mil, track to pad 6mil, pad to pad 6mil, via to via 6mil, smd to smd 0mil, copper to edge 10mil, drill to drill 10mil, minimum pad ring 10mil, minimum via ring 6mil, stop-mask expansion 2mil, vias tented up to drill 100mil, thermal gap 10mil
Holes 2.8 mm at 3.81,95.25 95.25,95.25 95.25,3.81 3.81,3.81 3.81,49.53 95.25,49.53

### Footprints (pad centres in the part's own frame; a part is rotated, then mirrored left to right if it is on the bottom)
1X02 = drill 1.016 long: 1 -1.27,0; 2 1.27,0
DIL40 = drill 0.813 long: 1 -24.13,-7.62; 2 -21.59,-7.62; 3 -19.05,-7.62; 4 -16.51,-7.62; 5 -13.97,-7.62; 6 -11.43,-7.62; 7 -8.89,-7.62; 8 -6.35,-7.62; 9 -3.81,-7.62; 10 -1.27,-7.62; 11 1.27,-7.62; 12 3.81,-7.62; 13 6.35,-7.62; 14 8.89,-7.62; 15 11.43,-7.62; 16 13.97,-7.62; 17 16.51,-7.62; 18 19.05,-7.62; 19 21.59,-7.62; 20 24.13,-7.62; 21 24.13,7.62; 22 21.59,7.62; 23 19.05,7.62; 24 16.51,7.62; 25 13.97,7.62; 26 11.43,7.62; 27 8.89,7.62; 28 6.35,7.62; 29 3.81,7.62; 30 1.27,7.62; 31 -1.27,7.62; 32 -3.81,7.62; 33 -6.35,7.62; 34 -8.89,7.62; 35 -11.43,7.62; 36 -13.97,7.62; 37 -16.51,7.62; 38 -19.05,7.62; 39 -21.59,7.62; 40 -24.13,7.62
TACTILE-PTH = drill 1.016 pad 1.88: 1 -3.251,2.261; 2 3.251,2.261; 3 -3.251,-2.261; 4 3.251,-2.261
C025-025X050 = drill 0.813 octagon: 1 -1.27,0; 2 1.27,0
1X08 = drill 1.016 long: 1 -8.89,0; 2 -6.35,0; 3 -3.81,0; 4 -1.27,0; 5 1.27,0; 6 3.81,0; 7 6.35,0; 8 8.89,0
DIL08 = drill 0.813 long: 1 -3.81,-3.81; 2 -1.27,-3.81; 3 1.27,-3.81; 4 3.81,-3.81; 5 3.81,3.81; 6 1.27,3.81; 7 -1.27,3.81; 8 -3.81,3.81
2X03 = drill 1.016 octagon: 1 -2.54,-1.27; 2 -2.54,1.27; 3 0,-1.27; 4 0,1.27; 5 2.54,-1.27; 6 2.54,1.27
LED5MM = drill 0.813 pad 1.88: A -1.27,0; K 1.27,0
1,6/0,9 = drill 0.914 pad 1.6 octagon: 1 0,0
1X03 = drill 1.016 long: 1 -2.54,0; 2 0,0; 3 2.54,0
1X04 = drill 1.016 long: 1 -3.81,0; 2 -1.27,0; 3 1.27,0; 4 3.81,0
0204/7 = drill 0.813 octagon: 1 -3.81,0; 2 3.81,0
1X06 = drill 1.016 long: 1 -6.35,0; 2 -3.81,0; 3 -1.27,0; 4 1.27,0; 5 3.81,0; 6 6.35,0
SHORT_TOP-50 = smd 1.27 x 1.27: 1 0.635,0; 2 -0.635,0
SSOP28DB = smd 0.348 x 1.397: 1 -4.225,-3.656; 2 -3.575,-3.656; 3 -2.925,-3.656; 4 -2.275,-3.656; 5 -1.625,-3.656; 6 -0.975,-3.656; 7 -0.325,-3.656; 8 0.325,-3.656; 9 0.975,-3.656; 10 1.625,-3.656; 11 2.275,-3.656; 12 2.925,-3.656; 13 3.575,-3.656; 14 4.225,-3.656; 15 4.225,3.656; 16 3.575,3.656; 17 2.925,3.656; 18 2.275,3.656; 19 1.625,3.656; 20 0.975,3.656; 21 0.325,3.656; 22 -0.325,3.656; 23 -0.975,3.656; 24 -1.625,3.656; 25 -2.275,3.656; 26 -2.925,3.656; 27 -3.575,3.656; 28 -4.225,3.656
TOGGLE-CYAN-LG-ZIK = drill 0.8 square: A2 7.62,7.62; A! 2.54,7.62; B1 2.54,2.54; B2 7.62,2.54; NA1 5.08,7.62; NA2 5.08,2.54
HC49/S = drill 0.813: 1 -2.413,0; 2 2.413,0

### Placement (x,y rotation side)
ALWAYS-ON  76.2,11.43 0 top
AREF-JP  33.02,55.88 0 top
ATMEGA  33.02,38.1 0 top
BUT1  41.91,5.08 0 top
BUT2  53.34,5.08 0 top
C1  72.39,33.02 180 top
C2  72.39,26.67 0 top
C3  76.2,5.08 90 top
C4  33.02,25.4 0 top
C5  33.02,50.8 0 top
C6  29.21,20.32 180 top
C7  35.56,20.32 180 top
CTSGND  68.58,19.05 0 top
GPIO-A  13.97,55.88 0 top
GPIO-B  13.97,20.32 0 top
GPIO-C  50.8,55.88 180 top
GPIO-D  50.8,20.32 0 top
IC1  66.04,8.89 0 top
ISP  92.71,55.88 0 top
OPTBUT  31.75,12.7 0 top
OPTLED  83.82,55.88 0 top
OPTLED1  81.28,92.71 0 top
OPTLED2  90.17,92.71 0 top
P1  5.08,64.77 0 top
P2  7.62,64.77 0 top
P3  10.16,64.77 0 top
P4  12.7,64.77 0 top
P5  15.24,64.77 0 top
P6  17.78,64.77 0 top
P7  20.32,64.77 0 top
P8  22.86,64.77 0 top
P9  25.4,64.77 0 top
P10  27.94,64.77 0 top
P11  30.48,64.77 0 top
P12  33.02,64.77 0 top
P13  35.56,64.77 0 top
P14  38.1,64.77 0 top
P15  40.64,64.77 0 top
P16  43.18,64.77 0 top
P17  45.72,64.77 0 top
P18  48.26,64.77 0 top
P19  50.8,64.77 0 top
P20  53.34,64.77 0 top
P21  55.88,64.77 0 top
P22  58.42,64.77 0 top
P23  60.96,64.77 0 top
P24  63.5,64.77 0 top
P25  66.04,64.77 0 top
P26  68.58,64.77 0 top
P27  71.12,64.77 0 top
P28  73.66,64.77 0 top
P29  76.2,64.77 0 top
P30  78.74,64.77 0 top
P31  81.28,64.77 0 top
P32  83.82,64.77 0 top
P33  86.36,64.77 0 top
P34  88.9,64.77 0 top
P35  91.44,64.77 0 top
P36  93.98,64.77 0 top
P37  5.08,62.23 0 top
P38  7.62,62.23 0 top
P39  10.16,62.23 0 top
P40  12.7,62.23 0 top
P41  15.24,62.23 0 top
P42  5.08,76.2 0 top
P43  7.62,76.2 0 top
P44  10.16,76.2 0 top
P45  12.7,76.2 0 top
P46  15.24,76.2 0 top
P47  5.08,73.66 0 top
P48  7.62,73.66 0 top
P49  10.16,73.66 0 top
P50  12.7,73.66 0 top
P51  15.24,73.66 0 top
P52  5.08,71.12 0 top
P53  7.62,71.12 0 top
P54  10.16,71.12 0 top
P55  12.7,71.12 0 top
P56  15.24,71.12 0 top
P57  5.08,68.58 0 top
P58  7.62,68.58 0 top
P59  10.16,68.58 0 top
P60  12.7,68.58 0 top
P61  15.24,68.58 0 top
P62  17.78,62.23 0 top
P63  17.78,71.12 0 top
P64  20.32,62.23 0 top
P65  20.32,73.66 0 top
P66  20.32,68.58 0 top
P67  17.78,76.2 0 top
P68  17.78,68.58 0 top
P69  20.32,76.2 0 top
P70  20.32,71.12 0 top
P71  22.86,62.23 0 top
P72  17.78,73.66 0 top
P73  22.86,68.58 0 top
P74  27.94,62.23 0 top
P75  27.94,76.2 0 top
P76  27.94,71.12 0 top
P77  27.94,68.58 0 top
P78  33.02,62.23 0 top
P79  35.56,62.23 0 top
P80  38.1,62.23 0 top
P81  40.64,62.23 0 top
P82  43.18,62.23 0 top
P83  30.48,62.23 0 top
P84  45.72,62.23 0 top
P85  48.26,62.23 0 top
P86  50.8,62.23 0 top
P87  53.34,62.23 0 top
P88  55.88,62.23 0 top
P89  58.42,62.23 0 top
P90  60.96,62.23 0 top
P91  63.5,62.23 0 top
P92  66.04,62.23 0 top
P93  68.58,62.23 0 top
P94  71.12,62.23 0 top
P95  73.66,62.23 0 top
P96  76.2,62.23 0 top
P97  78.74,62.23 0 top
P98  81.28,62.23 0 top
P99  83.82,62.23 0 top
P100  22.86,76.2 0 top
P101  25.4,76.2 0 top
P102  25.4,73.66 0 top
P103  25.4,71.12 0 top
P104  22.86,73.66 0 top
P105  22.86,71.12 0 top
P106  25.4,68.58 0 top
P107  27.94,73.66 0 top
P108  25.4,62.23 0 top
P109  86.36,62.23 0 top
P110  88.9,62.23 0 top
P111  91.44,62.23 0 top
P112  93.98,62.23 0 top
P113  30.48,76.2 0 top
P114  33.02,76.2 0 top
P115  35.56,76.2 0 top
P116  38.1,76.2 0 top
P117  40.64,76.2 0 top
P118  43.18,76.2 0 top
P119  45.72,76.2 0 top
P120  48.26,76.2 0 top
P121  50.8,76.2 0 top
P122  53.34,76.2 0 top
P123  55.88,76.2 0 top
P124  58.42,76.2 0 top
P125  60.96,76.2 0 top
P126  63.5,76.2 0 top
P127  66.04,76.2 0 top
P128  68.58,76.2 0 top
P129  71.12,76.2 0 top
P130  73.66,76.2 0 top
P139  30.48,73.66 0 top
P140  33.02,73.66 0 top
P141  35.56,73.66 0 top
P142  38.1,73.66 0 top
P143  40.64,73.66 0 top
P144  43.18,73.66 0 top
P145  30.48,71.12 0 top
P146  33.02,71.12 0 top
P147  35.56,71.12 0 top
P148  38.1,71.12 0 top
P149  40.64,71.12 0 top
P150  43.18,71.12 0 top
P151  45.72,73.66 0 top
P152  48.26,73.66 0 top
P153  50.8,73.66 0 top
P154  53.34,73.66 0 top
P155  55.88,73.66 0 top
P156  58.42,73.66 0 top
P157  60.96,73.66 0 top
P158  63.5,73.66 0 top
P159  93.98,73.66 0 top
P160  66.04,73.66 0 top
P161  68.58,73.66 0 top
P162  71.12,73.66 0 top
P163  73.66,73.66 0 top
P164  76.2,73.66 0 top
P165  78.74,73.66 0 top
P166  81.28,73.66 0 top
P167  83.82,73.66 0 top
P168  86.36,73.66 0 top
P169  88.9,73.66 0 top
P170  91.44,73.66 0 top
P171  45.72,71.12 0 top
P172  48.26,71.12 0 top
P173  50.8,71.12 0 top
P174  53.34,71.12 0 top
P175  55.88,71.12 0 top
P176  58.42,71.12 0 top
P177  60.96,71.12 0 top
P178  63.5,71.12 0 top
P179  66.04,71.12 0 top
P180  68.58,71.12 0 top
P183  10.16,95.25 0 top
P184  12.7,95.25 0 top
P185  15.24,95.25 0 top
P186  17.78,95.25 0 top
P187  20.32,95.25 0 top
P188  22.86,95.25 0 top
P189  25.4,95.25 0 top
P190  27.94,95.25 0 top
P191  30.48,95.25 0 top
P192  33.02,95.25 0 top
P193  35.56,95.25 0 top
P194  38.1,95.25 0 top
P195  40.64,95.25 0 top
P196  43.18,95.25 0 top
P197  45.72,95.25 0 top
P198  48.26,95.25 0 top
P199  50.8,95.25 0 top
P200  53.34,95.25 0 top
P201  55.88,95.25 0 top
P202  58.42,95.25 0 top
P203  60.96,95.25 0 top
P204  63.5,95.25 0 top
P205  66.04,95.25 0 top
P206  68.58,95.25 0 top
P207  71.12,95.25 0 top
P208  73.66,95.25 0 top
P211  10.16,92.71 0 top
P212  12.7,92.71 0 top
P213  15.24,92.71 0 top
P214  17.78,92.71 0 top
P215  20.32,92.71 0 top
P216  22.86,92.71 0 top
P217  25.4,92.71 0 top
P218  27.94,92.71 0 top
P219  30.48,92.71 0 top
P220  33.02,92.71 0 top
P221  35.56,92.71 0 top
P222  38.1,92.71 0 top
P223  40.64,92.71 0 top
P224  43.18,92.71 0 top
P225  45.72,92.71 0 top
P226  48.26,92.71 0 top
P227  50.8,92.71 0 top
P228  53.34,92.71 0 top
P229  55.88,92.71 0 top
P230  58.42,92.71 0 top
P231  60.96,92.71 0 top
P232  63.5,92.71 0 top
P233  66.04,92.71 0 top
P234  68.58,92.71 0 top
P235  71.12,92.71 0 top
P236  73.66,92.71 0 top
P237  5.08,88.9 0 top
P238  7.62,88.9 0 top
P239  10.16,88.9 0 top
P240  12.7,88.9 0 top
P241  15.24,88.9 0 top
P242  17.78,88.9 0 top
P243  20.32,88.9 0 top
P244  22.86,88.9 0 top
P245  25.4,88.9 0 top
P246  27.94,88.9 0 top
P247  30.48,88.9 0 top
P248  33.02,88.9 0 top
P249  35.56,88.9 0 top
P250  38.1,88.9 0 top
P251  40.64,88.9 0 top
P252  43.18,88.9 0 top
P253  45.72,88.9 0 top
P254  48.26,88.9 0 top
P255  50.8,88.9 0 top
P256  53.34,88.9 0 top
P257  55.88,88.9 0 top
P258  58.42,88.9 0 top
P259  60.96,88.9 0 top
P260  63.5,88.9 0 top
P261  66.04,88.9 0 top
P262  68.58,88.9 0 top
P263  71.12,88.9 0 top
P264  73.66,88.9 0 top
P265  5.08,86.36 0 top
P266  7.62,86.36 0 top
P267  10.16,86.36 0 top
P268  12.7,86.36 0 top
P269  15.24,86.36 0 top
P270  17.78,86.36 0 top
P271  20.32,86.36 0 top
P272  22.86,86.36 0 top
P273  25.4,86.36 0 top
P274  27.94,86.36 0 top
P275  30.48,86.36 0 top
P276  33.02,86.36 0 top
P277  35.56,86.36 0 top
P278  38.1,86.36 0 top
P279  40.64,86.36 0 top
P280  43.18,86.36 0 top
P281  45.72,86.36 0 top
P282  48.26,86.36 0 top
P283  50.8,86.36 0 top
P284  53.34,86.36 0 top
P285  55.88,86.36 0 top
P286  58.42,86.36 0 top
P287  60.96,86.36 0 top
P288  63.5,86.36 0 top
P289  30.48,68.58 0 top
P290  33.02,68.58 0 top
P291  35.56,68.58 0 top
P292  38.1,68.58 0 top
P293  40.64,68.58 0 top
P294  43.18,68.58 0 top
P295  45.72,68.58 0 top
P296  48.26,68.58 0 top
P297  50.8,68.58 0 top
P298  53.34,68.58 0 top
P299  55.88,68.58 0 top
P300  58.42,68.58 0 top
P301  60.96,68.58 0 top
P302  63.5,68.58 0 top
P303  66.04,68.58 0 top
P304  68.58,68.58 0 top
P305  71.12,71.12 0 top
P306  73.66,71.12 0 top
P307  76.2,71.12 0 top
P308  78.74,71.12 0 top
P309  81.28,71.12 0 top
P310  83.82,71.12 0 top
P311  86.36,71.12 0 top
P312  88.9,71.12 0 top
P313  91.44,71.12 0 top
P314  93.98,71.12 0 top
P315  71.12,68.58 0 top
P316  73.66,68.58 0 top
P317  76.2,68.58 0 top
P318  78.74,68.58 0 top
P319  81.28,68.58 0 top
P320  83.82,68.58 0 top
P321  86.36,68.58 0 top
P322  88.9,68.58 0 top
P323  91.44,68.58 0 top
P324  93.98,68.58 0 top
P325  66.04,86.36 0 top
P326  68.58,86.36 0 top
P327  71.12,86.36 0 top
P328  73.66,86.36 0 top
P329  5.08,83.82 0 top
P330  7.62,83.82 0 top
P331  10.16,83.82 0 top
P332  12.7,83.82 0 top
P333  15.24,83.82 0 top
P334  17.78,83.82 0 top
P335  20.32,83.82 0 top
P336  22.86,83.82 0 top
P337  25.4,83.82 0 top
P338  27.94,83.82 0 top
P339  30.48,83.82 0 top
P340  33.02,83.82 0 top
P341  35.56,83.82 0 top
P342  38.1,83.82 0 top
P343  40.64,83.82 0 top
P344  43.18,83.82 0 top
P345  45.72,83.82 0 top
P346  48.26,83.82 0 top
P347  50.8,83.82 0 top
P348  53.34,83.82 0 top
P349  55.88,83.82 0 top
P350  58.42,83.82 0 top
P351  60.96,83.82 0 top
P352  63.5,83.82 0 top
P353  66.04,83.82 0 top
P354  68.58,83.82 0 top
P355  71.12,83.82 0 top
P356  73.66,83.82 0 top
P357  5.08,81.28 0 top
P358  7.62,81.28 0 top
P359  10.16,81.28 0 top
P360  12.7,81.28 0 top
P361  15.24,81.28 0 top
P362  17.78,81.28 0 top
P363  20.32,81.28 0 top
P364  22.86,81.28 0 top
P365  25.4,81.28 0 top
P366  27.94,81.28 0 top
P367  30.48,81.28 0 top
P368  33.02,81.28 0 top
P369  35.56,81.28 0 top
P370  38.1,81.28 0 top
P371  40.64,81.28 0 top
P372  43.18,81.28 0 top
P373  45.72,81.28 0 top
P374  48.26,81.28 0 top
P375  50.8,81.28 0 top
P376  53.34,81.28 0 top
P377  55.88,81.28 0 top
P378  58.42,81.28 0 top
P379  60.96,81.28 0 top
P380  63.5,81.28 0 top
P381  5.08,78.74 0 top
P382  7.62,78.74 0 top
P383  10.16,78.74 0 top
P384  12.7,78.74 0 top
P385  15.24,78.74 0 top
P386  17.78,78.74 0 top
P387  20.32,78.74 0 top
P388  25.4,78.74 0 top
P389  27.94,78.74 0 top
P390  30.48,78.74 0 top
P391  22.86,78.74 0 top
P392  33.02,78.74 0 top
P393  35.56,78.74 0 top
P394  38.1,78.74 0 top
P395  40.64,78.74 0 top
P396  43.18,78.74 0 top
P397  45.72,78.74 0 top
P398  48.26,78.74 0 top
P399  50.8,78.74 0 top
P400  53.34,78.74 0 top
P401  55.88,78.74 0 top
P402  58.42,78.74 0 top
P403  60.96,78.74 0 top
P404  63.5,78.74 0 top
P405  66.04,81.28 0 top
P406  68.58,81.28 0 top
P407  71.12,81.28 0 top
P408  73.66,81.28 0 top
P409  66.04,78.74 0 top
P410  68.58,78.74 0 top
P411  71.12,78.74 0 top
P412  73.66,78.74 0 top
PD0-TXD  77.47,46.99 180 top
PD1-RXD  77.47,40.64 180 top
PWR  26.67,5.08 0 top
PWRIN  95.25,11.43 90 top
PWROUT  95.25,25.4 90 top
R1  20.32,12.7 0 top
R2  92.71,86.36 0 top
R3  67.31,49.53 180 top
R4  53.34,12.7 0 top
R5  82.55,86.36 0 top
R6  67.31,45.72 180 top
R8  41.91,12.7 0 top
R11  8.89,12.7 0 top
RESET  13.97,5.08 0 top
RXLED  76.2,55.88 0 top
SERSTATE  82.55,19.05 180 top
SH1  92.71,17.78 90 top
TXLED  68.58,55.88 0 top
U2  83.82,30.48 0 top
U$4  81.28,3.81 0 top
USB3->PWR  86.36,40.64 180 top
USB5->PWR  86.36,46.99 0 top
USBPORT  95.25,39.37 270 top
XTAL  64.77,34.29 90 top

### Tracks (layer width: path | path; a pad name or v marks a point on that pad's centre or on a via)
+5V
  Top 0.406: IC1.7 IC1.6 IC1.5 71.12,12.7 72.39,13.97 76.2,13.97 77.47,12.7 | C3.2 77.47,7.62 ALWAYS-ON.2 77.47,12.7 | 77.47,12.7 78.74,13.97 87.63,13.97 | 87.63,13.97 88.9,12.7 U$4.A2 | 87.63,13.97 90.17,15.24 90.81,17.14 90.81,18.41 SH1.1 90.81,20.95 90.81,25.4 92.08,26.67 PWROUT.3
AREF
  Top 0.406: ATMEGA.32 29.21,54.61 30.48,55.88 AREF-JP.1
AT_MISO
  Top 0.406: ATMEGA.7 24.13,27.94 20.32,24.13 GPIO-B.7
  Bottom 0.305: ISP.1 90.17,54.29 88.27,52.39 70.8,52.39 69.22,50.8 69.22,46.04 64.77,41.59 57.78,41.59 54.61,38.42 26.67,38.42 24.13,35.88 ATMEGA.7
AT_MOSI
  Top 0.406: ATMEGA.6 21.59,27.94 17.78,24.13 GPIO-B.6
  Bottom 0.305: ISP.4 92.71,58.74 92.39,59.05 89.22,59.05 87.31,57.15 87.31,55.24 85.09,53.02 70.48,53.02 68.26,50.8 68.26,46.35 64.45,42.55 57.47,42.55 54.29,39.37 26.04,39.37 21.59,34.92 ATMEGA.6
AT_RESET
  Top 0.406: ATMEGA.9 29.21,27.94 25.4,24.13 25.4,19.05 22.86,16.51 15.24,16.51 12.7,13.97 R11.2 12.7,4.8 RESET.3
  Bottom 0.305: ISP.5 95.25,53.02 94.61,52.39 93.66,52.39 92.08,50.8 76.2,50.8 73.98,48.58 73.98,43.5 64.77,34.29 30.8,34.29 29.21,32.7 ATMEGA.9
AT_SCK
  Top 0.406: ATMEGA.8 26.67,27.94 22.86,24.13 GPIO-B.8
  Bottom 0.305: ISP.3 92.71,52.39 91.76,51.44 75.88,51.44 73.03,48.58 73.03,44.13 68.58,39.69 62.23,39.69 57.78,35.24 28.57,35.24 26.67,33.34 ATMEGA.8
CTS  (via drill 0.6)
  Top 0.305: U2.11 86.09,28.31 86.36,28.57 88.27,28.57 89.53,27.3 v89.53,24.77 | v87.63,22.86 87.63,16.51 87,15.88 77.47,15.88 76.2,17.14 SERSTATE.6 CTSGND.2
  Bottom 0.305: v89.53,24.77 v87.63,22.86
DCD
  Top 0.305: U2.10 85.44,24.41 86.36,23.5 SERSTATE.2
DSR
  Top 0.305: U2.9 84.8,24.47 83.82,23.5 SERSTATE.3
DTR
  Top 0.305: U2.2 80.25,23.89 81.28,22.86 SERSTATE.4
FTDI3  (via drill 0.6)
  Top 0.305: USB3->PWR.1 87.63,38.1 86.75,37.22 U2.17 86.68,34.07 v86.68,30.48 | C1.1 75.56,30.48 v80.01,30.48
  Bottom 0.305: v80.01,30.48 v86.68,30.48
GND  (via drill 0.3, 0.6)
  Top 0.305: 83.82,32.38 84.14,32.71 U2.21 v84.14,31.76 v84.14,31.75 | 83.82,32.38 81.92,32.38 81.55,32.76 U2.25 U2.26 | 83.82,32.38 83.5,32.06 U2.7 | 86.04,32.07 v85.72,31.75 86.09,32.12 U2.18
  Bottom 0.305: v84.14,31.75 v85.72,31.75
  pour Bottom: 0,99.06 0,0 99.06,0 99.06,99.06
N$1
  Top 0.406: R8.1 38.1,13.97 36.83,15.24 31.75,15.24 30.48,13.97 OPTBUT.1 30.48,10.16 33.3,7.34 BUT1.1
N$2
  Top 0.406: OPTBUT.2 33.02,11.43 34.29,10.16 46.99,10.16 | 46.99,10.16 R4.1 | BUT2.1 49.81,7.34 46.99,10.16
N$3
  Top 0.406: R1.1 19.05,12.7 20.32,11.43 20.32,6.35 21.59,5.08 PWR.A
N$4
  Top 0.305: TXLED.A 64.77,55.88 59.69,50.8 59.69,46.99 60.96,45.72 R6.2
N$5
  Top 0.305: R5.2 88.9,83.82 95.25,83.82 96.52,82.55 96.52,62.23 95.89,60.96 94.61,60.33 84.45,60.33 82.55,58.42 OPTLED.1
N$6
  Top 0.305: R2.1 OPTLED2.A
N$7
  Top 0.305: R2.2 97.79,85.09 97.79,60.96 96.52,59.69 87.63,59.69 85.09,57.15 OPTLED.2
N$8
  Top 0.305: U2.23 82.84,36.53 81.92,37.47 81.92,48.26 81.28,48.9 74.3,48.9 R6.1
N$9
  Top 0.305: R5.1 78.74,91.44 OPTLED1.A
N$10
  Top 0.305: R3.2 63.5,50.8 64.77,52.07 72.39,52.07 74.93,54.61 RXLED.A
N$11
  Top 0.305: U2.22 83.5,36.84 82.55,37.78 82.55,48.9 81.92,49.53 R3.1
N$12  (via drill 0.6)
  Top 0.305: U2.1 79.57,26.79 79.57,25.34 v79.25,25.02
  Bottom 0.305: v79.25,25.02 77.41,25.02 76.9,25.53 76.9,35.88 77.53,36.51 79.06,36.51 80.64,38.1 80.64,43.18 79.82,44.45 78.74,45.53 PD0-TXD.1
N$13  (via drill 0.3)
  Top 0.305: U2.5 82.19,28.54 82.23,28.57 82.23,24.45 v81.6,23.81
  Bottom 0.305: v81.6,23.81 77.47,23.81 75.88,25.4 75.88,35.88 78.74,38.73 PD1-RXD.1
PA0
  Top 0.406: ATMEGA.40 8.89,49.53 5.08,53.34 GPIO-A.1
PA1
  Top 0.406: ATMEGA.39 11.43,49.53 7.62,53.34 GPIO-A.2
PA2
  Top 0.406: ATMEGA.38 13.97,49.53 10.16,53.34 GPIO-A.3
PA3
  Top 0.406: ATMEGA.37 16.51,49.53 12.7,53.34 GPIO-A.4
PA4
  Top 0.406: ATMEGA.36 19.05,49.53 15.24,53.34 GPIO-A.5
PA5
  Top 0.406: ATMEGA.35 21.59,49.53 17.78,53.34 GPIO-A.6
PA6
  Top 0.406: ATMEGA.34 24.13,49.53 20.32,53.34 GPIO-A.7
PA7
  Top 0.406: ATMEGA.33 26.67,49.53 22.86,53.34 GPIO-A.8
PB0
  Top 0.406: ATMEGA.1 8.89,27.94 5.08,24.13 GPIO-B.1
PB1
  Top 0.406: ATMEGA.2 11.43,27.94 7.62,24.13 GPIO-B.2
PB2
  Top 0.406: ATMEGA.3 13.97,27.94 10.16,24.13 GPIO-B.3
PB3
  Top 0.406: ATMEGA.4 16.51,27.94 12.7,24.13 GPIO-B.4
PB4
  Top 0.406: ATMEGA.5 19.05,27.94 15.24,24.13 GPIO-B.5
PC0
  Top 0.406: ATMEGA.22 54.61,48.26 59.69,53.34 GPIO-C.1
PC1
  Top 0.406: ATMEGA.23 52.07,48.26 57.15,53.34 GPIO-C.2
PC2
  Top 0.406: ATMEGA.24 49.53,48.26 54.61,53.34 GPIO-C.3
PC3
  Top 0.406: ATMEGA.25 46.99,48.26 52.07,53.34 GPIO-C.4
PC4
  Top 0.406: ATMEGA.26 44.45,48.26 49.53,53.34 GPIO-C.5
PC5
  Top 0.406: ATMEGA.27 41.91,48.26 46.99,53.34 GPIO-C.6
PC6
  Top 0.406: ATMEGA.28 39.37,48.26 44.45,53.34 GPIO-C.7
PC7
  Top 0.406: ATMEGA.29 36.83,48.26 41.91,53.34 GPIO-C.8
PD0  (via drill 0.6)
  Top 0.305: ATMEGA.14 41.91,26.04 v43.18,24.77
  Top 0.406: ATMEGA.14 GPIO-D.1
  Bottom 0.305: v43.18,24.77 65.72,24.77 66.67,25.72 66.67,34.61 76.2,44.13 PD0-TXD.2
PD1  (via drill 0.6)
  Top 0.305: ATMEGA.15 44.45,24.13 v45.4,23.18
  Top 0.406: ATMEGA.15 GPIO-D.2
  Bottom 0.305: v45.4,23.18 66.04,23.18 67.31,24.45 67.31,33.97 73.98,40.64 PD1-RXD.2
PD2
  Top 0.406: ATMEGA.16 GPIO-D.3
PD3
  Top 0.406: ATMEGA.17 GPIO-D.4
PD4
  Top 0.406: ATMEGA.18 GPIO-D.5
PD5
  Top 0.406: ATMEGA.19 GPIO-D.6
PD6
  Top 0.406: ATMEGA.20 GPIO-D.7
PD7
  Top 0.406: ATMEGA.21 57.15,41.91 66.04,41.91 68.58,39.37 68.58,27.94 66.04,25.4 60.96,25.4 59.69,24.13 GPIO-D.8
PWR
  pour Top: 0,99.06 99.06,99.06 99.06,0 0,0
RI  (via drill 0.6)
  Top 0.305: U2.6 82.84,25.11 v83.19,24.77 | v87,24.77 87.63,24.77 88.9,23.5 SERSTATE.1
  Bottom 0.305: v83.19,24.77 v87,24.77
RTS
  Top 0.305: U2.3 80.89,28.32 80.64,28.57 79.38,28.57 78.11,27.3 78.11,23.5 78.74,22.86 SERSTATE.5
USB5  (via drill 0.6)
  Top 0.305: U2.4 81.55,28.95 81.28,29.21 | 81.28,29.21 71.75,29.21 71.12,28.57 C2.1 | 81.28,29.21 81.92,29.84 v82.55,29.53 | v84.45,29.53 84.8,29.87 U2.20 U2.19 85.44,35.84 83.19,38.1 83.19,45.09 USB5->PWR.1 85.09,46.35 87,44.45 93.98,44.45 USBPORT.1
  Bottom 0.305: v82.55,29.53 v84.45,29.53
USB_D+
  Top 0.305: U2.15 88.05,35.34 88.27,35.56 90.81,35.56 93.34,38.1 USBPORT.3
USB_D-
  Top 0.305: U2.16 87.39,35.96 87.63,36.2 90.17,36.2 92.71,38.73 92.71,40.01 93.34,40.64 USBPORT.2
V+
  Top 0.406: PWRIN.2 93.98,11.43 92.71,12.7 SH1.2 93.34,17.14 94.61,18.41 94.61,19.05 92.08,21.59 92.08,22.86 93.34,24.13 PWROUT.2
VCC
  Top 0.406: IC1.3 IC1.4 71.12,5.08 74.3,1.91 78.11,1.91 80.64,4.45 80.64,6.99 82.55,8.89 PWRIN.1 96.52,8.89 97.79,10.16 97.79,20.32 96.52,21.59 PWROUT.1
XTAL1
  Top 0.406: C7.1 39.37,22.86 ATMEGA.13 39.37,34.29 40.64,35.56 60.96,35.56 64.64,31.88 XTAL.1
XTAL2
  Top 0.406: C6.1 33.02,22.86 35.56,22.86 36.83,24.13 ATMEGA.12 36.83,34.29 39.37,36.83 64.64,36.83 XTAL.2

### Text on the board
tPlace: G | + | atmega644 (32, ...) / www.zikzak.ca | Zok 11-2014 / Jeff Mitchell | G | + | PA0 | PA7 | PC7 | PC0 | 1 | 2 | 1 | 1 | V / - / + / G | RX | TX | RX2 | TX2 | PD7 | 1 | PB0 | PB7 | PD0 | 1 | 1 | 2 | 1
bPlace: G | + | G | + | PA0 | PA7 | PC7 | PC0 | PD7 | PB0 | PB7 | PD0